# EAGLE board Power_FM (EAGLE 5.11), part 1 of 3
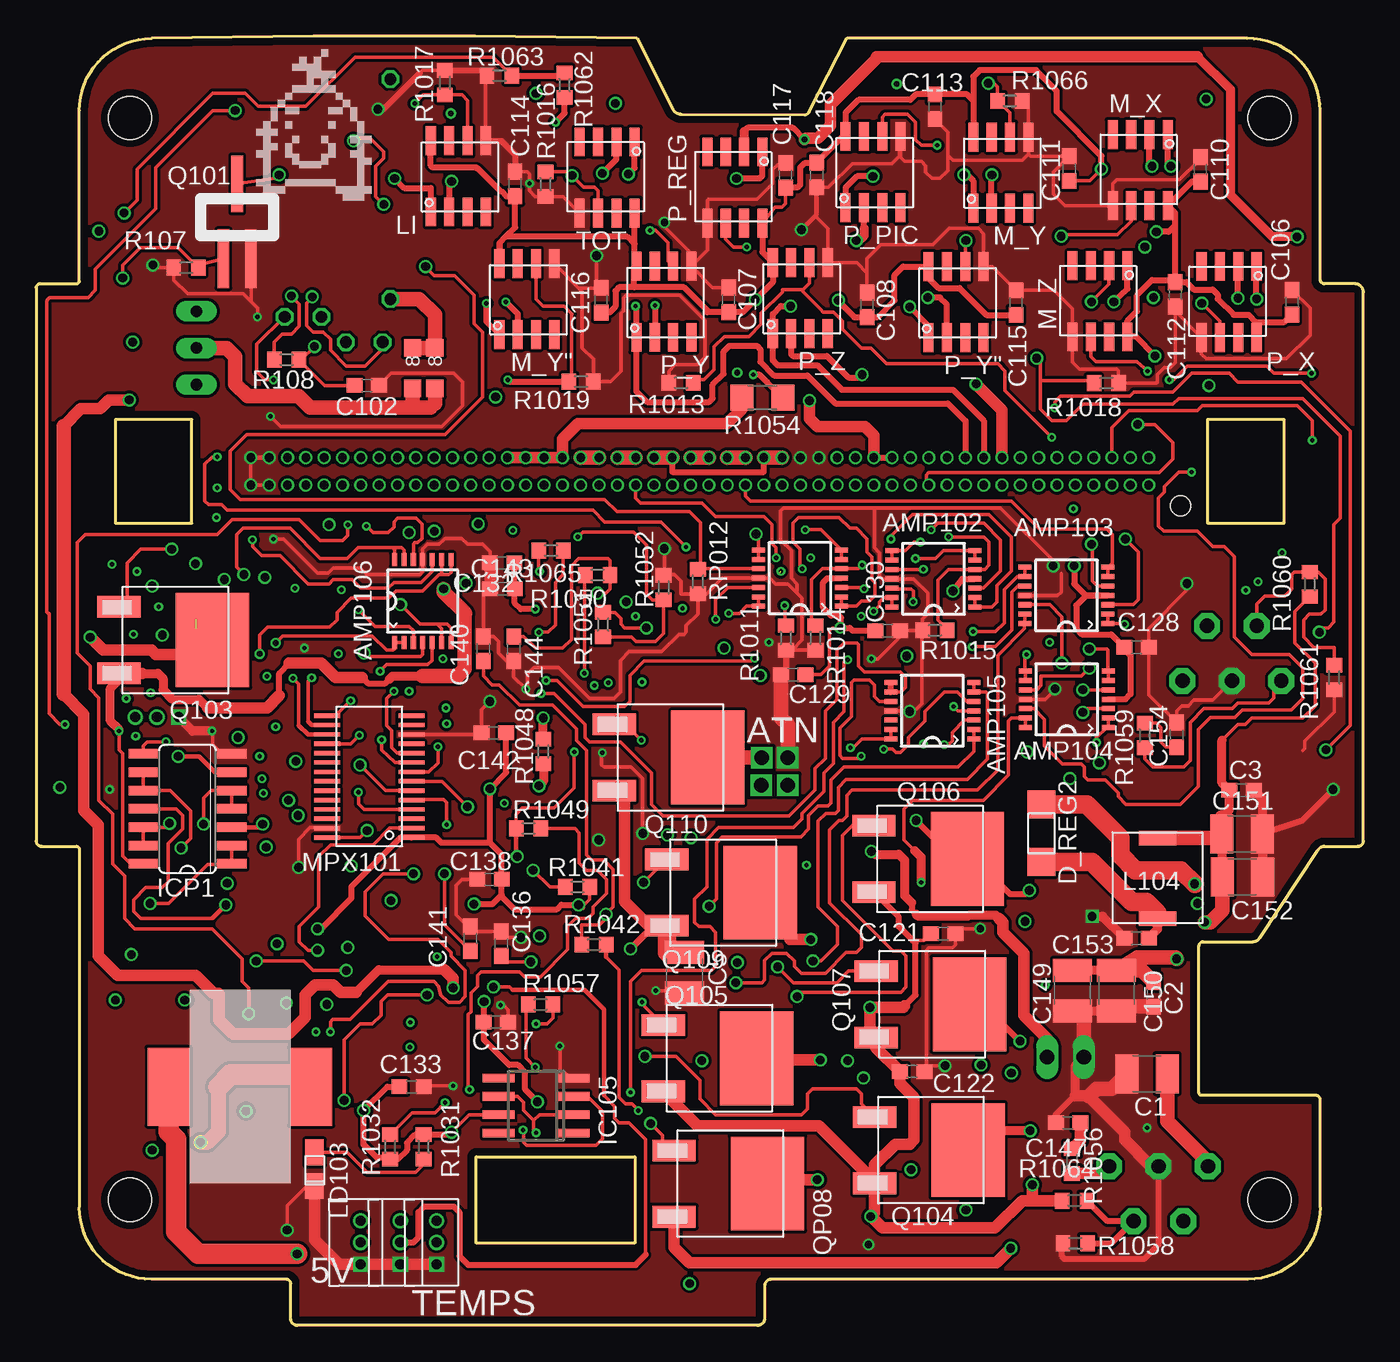
[diagram p10: board, top side]
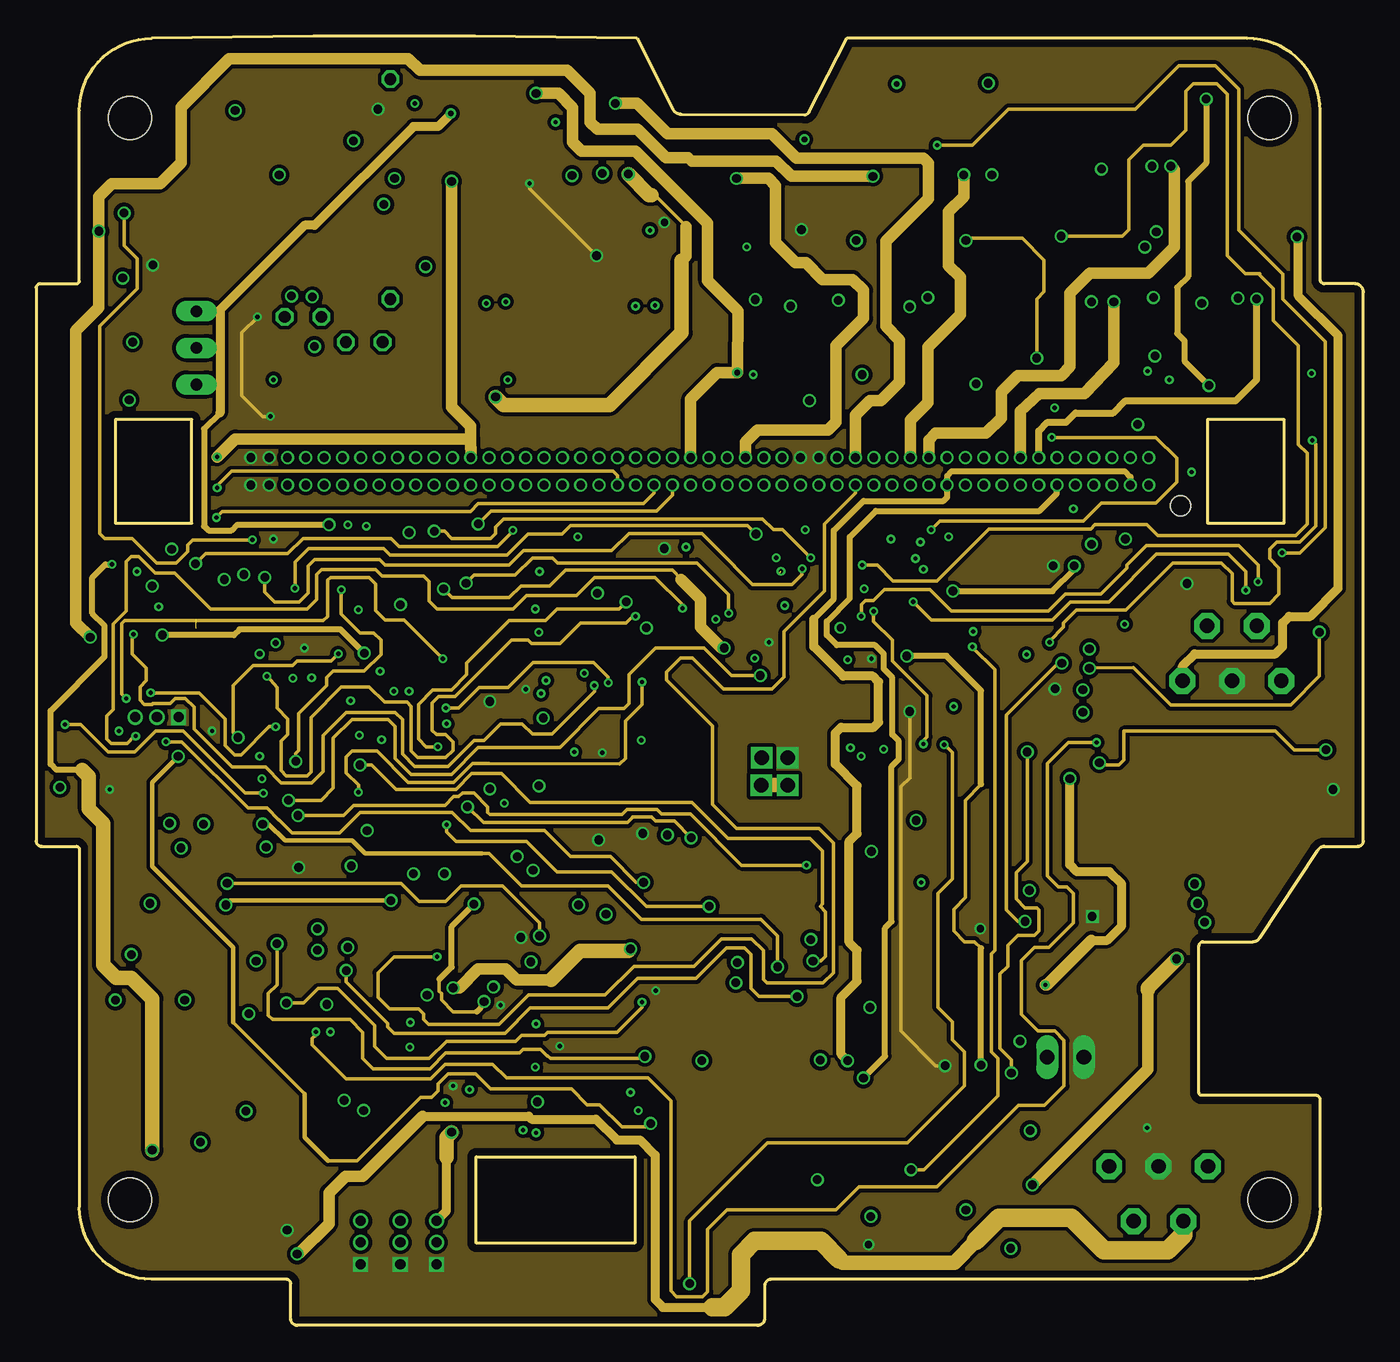
[diagram p11: board, inner layer Route2]
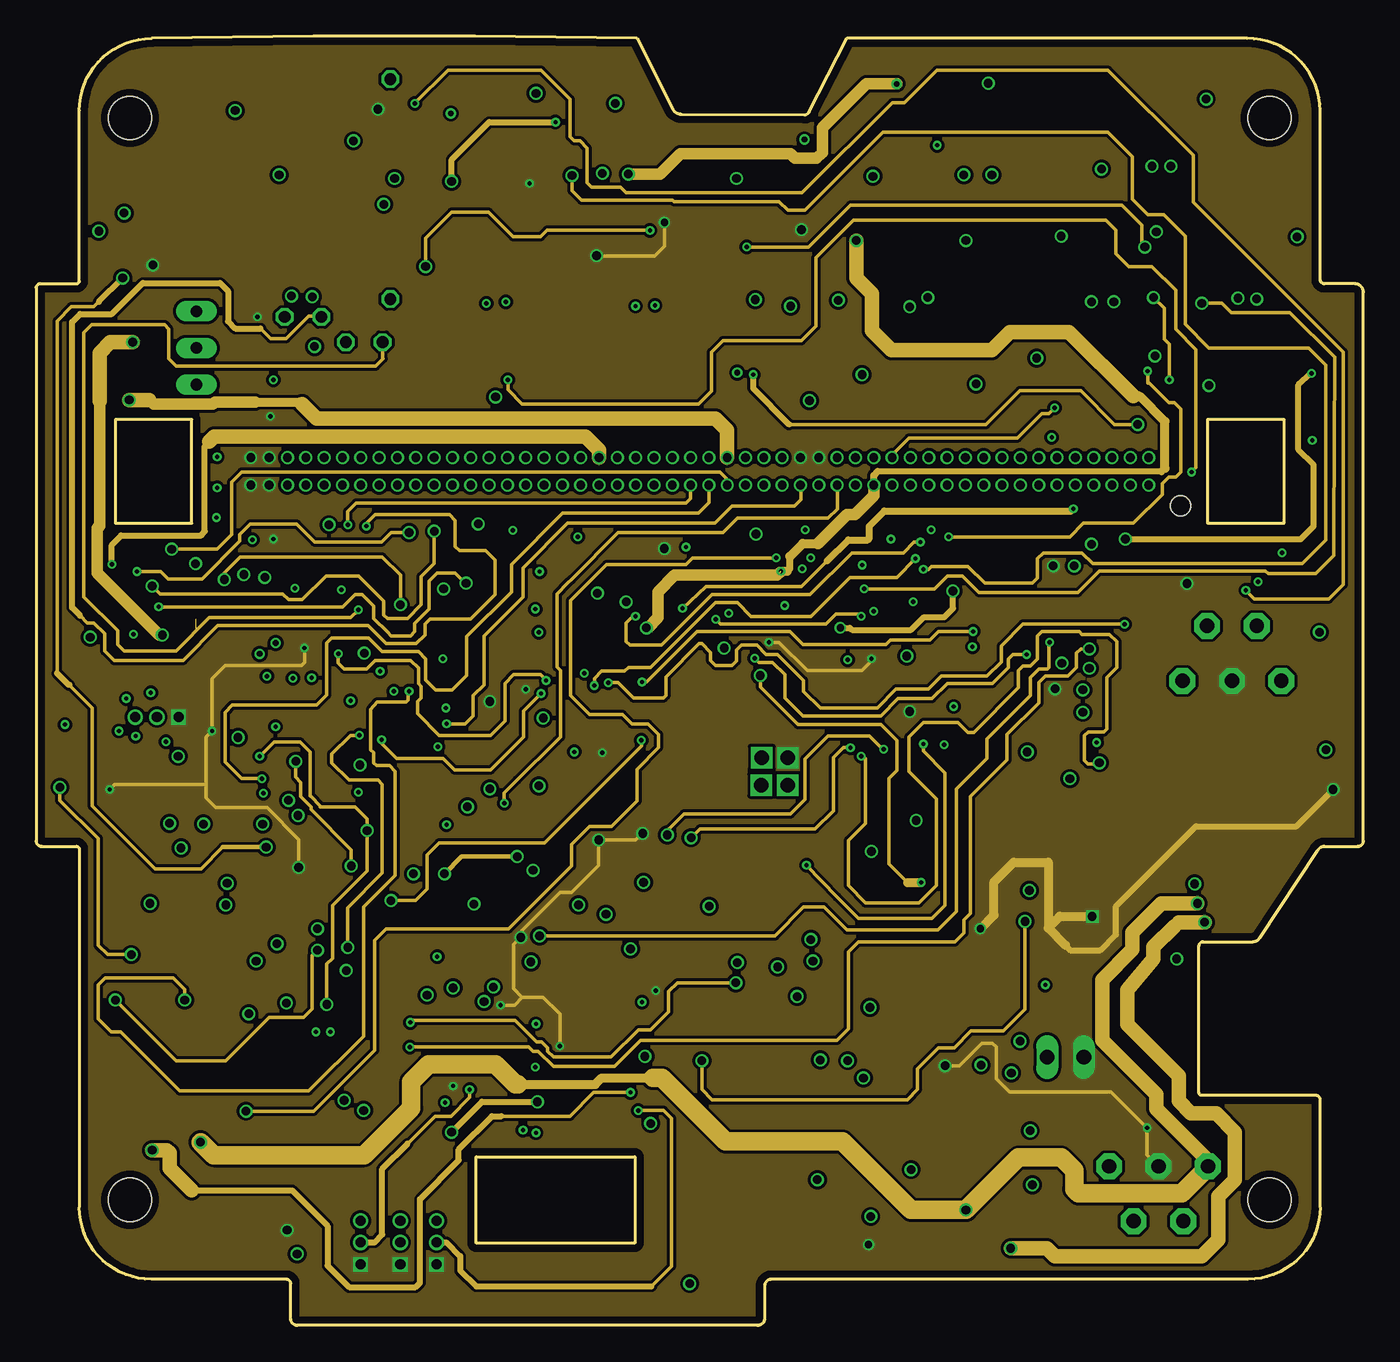
[diagram p12: board, inner layer Route15]
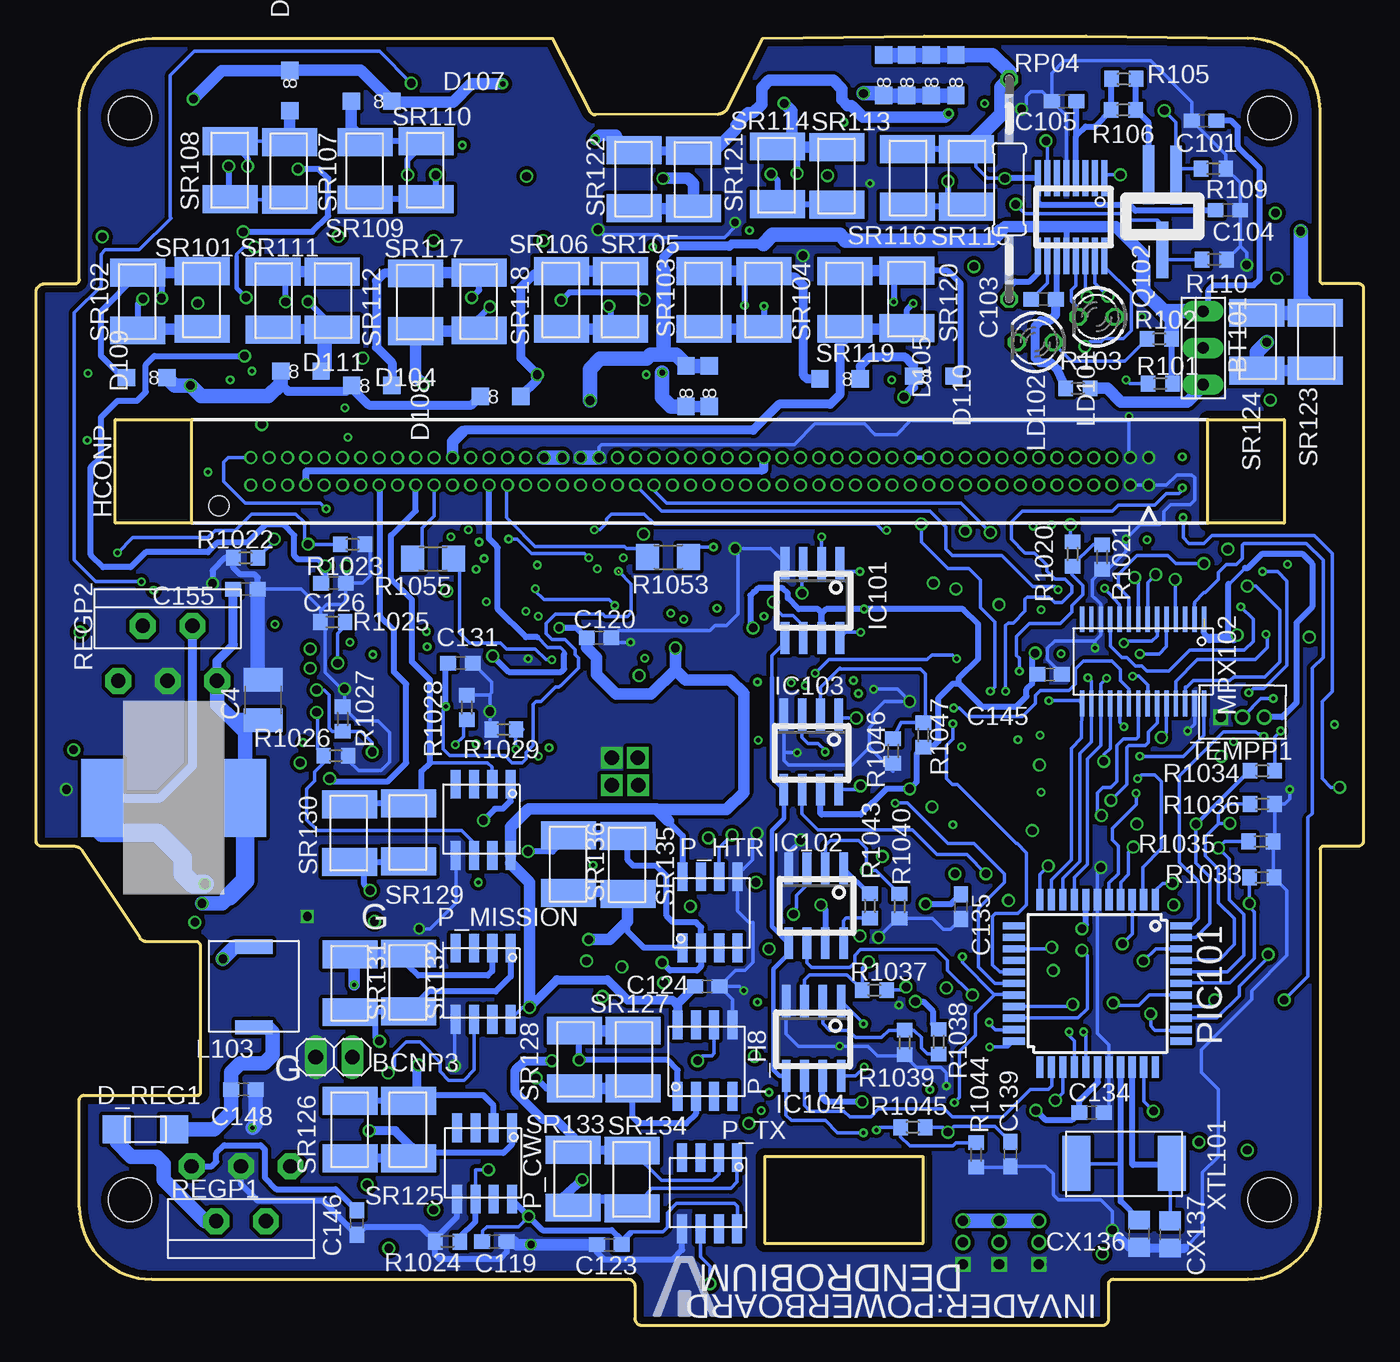
[diagram p13: board, bottom side, seen from below]

Size 92 x 89.37 mm. Coordinates in mm from the lower left corner, seen from the top.
Outline: 89,8.2 arc-90 84,3.2 50.95,3.2 arc90 50.5,2.75 50.5,0.5 arc-90 50,0 18.1,0 arc-90 17.65,0.45 17.65,2.9 arc90 17.35,3.2 8,3.2 arc-90 3,8.2 3,33 arc90 2.8,33.2 0.4,33.2 arc-90 0,33.6 0,71.9 arc-90 0.3,72.2 2.8,72.2 arc90 3,72.4 3,84.2 arc-90 8,89.2 arc-3 41.65,89.2 44.15,84.25 arc55 44.75,83.95 53.24,83.9 arc45 53.57,84.07 56.2,89.2 83.95,89.2 arc-90 89,84.2 89,72.5 arc90 89.3,72.2 91.4,72.2 arc-90 92,71.6 92,33.6 arc-90 91.6,33.2 89.3,33.2 arc62 88.8,32.9 84.8,26.85 arc-58 84.35,26.6 80.9,26.6 arc90 80.6,26.3 80.6,16.15 arc90 80.8,15.95 88.7,15.95 arc-90 89,15.65 89,8.2
Outline: 30.5,11.7 41.5,11.7 41.5,5.7 30.5,5.7 30.5,11.7
Copper layers (1+2*15+16): Top 0.018mm / dielectric 0.25mm / Route2 0.035mm / dielectric 1mm / Route15 0.035mm / dielectric 0.25mm / Bottom 0.018mm
Design rules "pban_4mil-l4": minimum track width 0.1mm, minimum drill 0.3mm, track to track 0.1mm, track to pad 0.229mm, pad to pad 0.1mm, via to via 0.1mm, smd to smd 0.1mm, copper to edge 0.5mm, drill to drill 0.5mm, minimum pad ring 0.15mm, minimum via ring 0.15mm, stop-mask expansion 4mil, vias tented up to drill 0.35mm, thermal gap 10mil
Holes 3 mm at 85.5,83.7 85.5,8.7 6.5,83.7 6.5,8.7

## Footprints (pad centres in the part's own frame; a part is rotated, then mirrored left to right if it is on the bottom)
AD8554ARUZ = smd 0.9 x 0.35: +INA -2.875,0.65; +INB -2.875,-0.65; +INC 2.875,-0.65; +IND 2.875,0.65; -INA -2.875,1.3; -INB -2.875,-1.3; -INC 2.875,-1.3; -IND 2.875,1.3; OUTA -2.875,1.95; OUTB -2.875,-1.95; OUTC 2.875,-1.95; OUTD 2.875,1.95; V+ -2.875,0; V- 2.875,0
1X02 = drill 1.016 long: 1 -1.27,0; 2 1.27,0
BAT_CON1 = drill 0.7 round: 1 -1.5,0; 2 0,0 | drill 0.7 square: 3 1.5,0
2-7D101A = drill 0.8 pad 1.422 long: P$1 -2.54,0; P$2 0,0; P$3 2.54,0
C1210 = smd 1.6 x 2.7: 1 -1.4,0; 2 1.4,0
C0603 = smd 1.1 x 1: 1 -0.85,0; 2 0.85,0
MM1639 = smd 0.406 x 2.5: P$1 -2.54,2.756; P$2 -1.88,2.756; P$3 -1.219,2.756; P$4 -0.559,2.756; P$5 0.102,2.756; P$6 0.762,2.756; P$7 1.422,2.756; P$8 2.083,2.756; P$9 2.083,-2.629; P$10 1.422,-2.629; P$11 0.762,-2.629; P$12 0.102,-2.629; P$13 -0.559,-2.629; P$14 -1.219,-2.629; P$15 -1.88,-2.629; P$16 -2.54,-2.629
C0805 = smd 1.3 x 1.5: 1 -0.95,0; 2 0.95,0
DIODE_FM = smd 1.2 x 1.2: P$1 -1.4,0; P$2 1.4,0
DIO = smd 1.93 x 1.93: P$1 3.4,0.9; P$2 -0.6,0.9
XH3B-013P-D5F = drill 0.6 pad 0.9 round: A1 -31.115,0.953; A2 -29.845,0.953; A3 -28.575,0.953; A4 -27.305,0.953; A5 -26.035,0.953; A6 -24.765,0.953; A7 -23.495,0.953; A8 -22.225,0.953; A9 -20.955,0.953; A10 -19.685,0.953; A11 -18.415,0.953; A12 -17.145,0.953; A13 -15.875,0.953; A14 -14.605,0.953; A15 -13.335,0.953; A16 -12.065,0.953; A17 -10.795,0.953; A18 -9.525,0.953; A19 -8.255,0.953; A20 -6.985,0.953; A21 -5.715,0.953; A22 -4.445,0.953; A23 -3.175,0.953; A24 -1.905,0.953; A25 -0.635,0.953; A26 0.635,0.953; A27 1.905,0.953; A28 3.175,0.953; A29 4.445,0.953; A30 5.715,0.953; A31 6.985,0.953; A32 8.255,0.953; A33 9.525,0.953; A34 10.795,0.953; A35 12.065,0.953; A36 13.335,0.953; A37 14.605,0.953; A38 15.875,0.953; A39 17.145,0.953; A40 18.415,0.953; A41 19.685,0.953; A42 20.955,0.953; A43 22.225,0.953; A44 23.495,0.953; A45 24.765,0.953; A46 26.035,0.953; A47 27.305,0.953; A48 28.575,0.953; A49 29.845,0.953; A50 31.115,0.953; B1 -31.115,-0.953; B2 -29.845,-0.953; B3 -28.575,-0.953; B4 -27.305,-0.953; B5 -26.035,-0.953; B6 -24.765,-0.953; B7 -23.495,-0.953; B8 -22.225,-0.953; B9 -20.955,-0.953; B10 -19.685,-0.953; B11 -18.415,-0.953; B12 -17.145,-0.953; B13 -15.875,-0.953; B14 -14.605,-0.953; B15 -13.335,-0.953; B16 -12.065,-0.953; B17 -10.795,-0.953; B18 -9.525,-0.953; B19 -8.255,-0.953; B20 -6.985,-0.953; B21 -5.715,-0.953; B22 -4.445,-0.953; B23 -3.175,-0.953; B24 -1.905,-0.953; B25 -0.635,-0.953; B26 0.635,-0.953; B27 1.905,-0.953; B28 3.175,-0.953; B29 4.445,-0.953; B30 5.715,-0.953; B31 6.985,-0.953; B32 8.255,-0.953; B33 9.525,-0.953; B34 10.795,-0.953; B35 12.065,-0.953; B36 13.335,-0.953; B37 14.605,-0.953; B38 15.875,-0.953; B39 17.145,-0.953; B40 18.415,-0.953; B41 19.685,-0.953; B42 20.955,-0.953; B43 22.225,-0.953; B44 23.495,-0.953; B45 24.765,-0.953; B46 26.035,-0.953; B47 27.305,-0.953; B48 28.575,-0.953; B49 29.845,-0.953; B50 31.115,-0.953 | hole 1.4: 33.315,2.4
SO8 = smd 0.6 x 2.2: 1 -1.905,-2.6; 2 -0.635,-2.6; 3 0.635,-2.6; 4 1.905,-2.6; 5 1.905,2.6; 6 0.635,2.6; 7 -0.635,2.6; 8 -1.905,2.6
SO14 = smd 0.66 x 2.032: 1 -3.81,-3.073; 2 -2.54,-3.073; 3 -1.27,-3.073; 4 0,-3.073; 5 1.27,-3.073; 6 2.54,-3.073; 7 3.81,-3.073; 8 3.81,3.073; 9 2.54,3.073; 10 1.27,3.073; 11 0,3.073; 12 -1.27,3.073; 13 -2.54,3.073; 14 -3.81,3.073
CDRH127 = smd 5.4 x 2.9: P$1 0,4.95; P$2 0,-4.95
IN = smd 1 x 2.6: P$1 6,3.1; P$2 0.4,3.1
LED3MM = drill 0.813 octagon: A -1.27,0; K 1.27,0
LED_CHIP = smd 1.778 x 1.27: P$1 -0.246,0.6; P$2 2.092,0.6
MAX4172 = smd 2 x 0.7: 1:RS+ 0,3.81; 2:RS- 0,2.54; 3:NC 0,1.27; 4:NC 0,0; 5:GND 4.93,0; 6:OUT 4.93,1.27; 7:PG 4.93,2.54; 8:V+ 4.93,3.81
ADG707 = smd 1.8 x 0.3: A0 2.925,-2.925; A1 2.925,-3.575; A2 2.925,-4.225; DA 2.925,4.225; DB -2.925,3.575; EN 2.925,-2.275; GND1 -2.925,-2.925; GND2 2.925,3.575; NC -2.925,-3.575; NC1 -2.925,2.925; NC2 -2.925,-4.225; S1A 2.925,-1.625; S1B -2.925,-2.275; S2A 2.925,-0.975; S2B -2.925,-1.625; S3A 2.925,-0.325; S3B -2.925,-0.975; S4A 2.925,0.325; S4B -2.925,-0.325; S5A 2.925,0.975; S5B -2.925,0.325; S6A 2.925,1.625; S6B -2.925,0.975; S7A 2.925,2.275; S7B -2.925,1.625; S8A 2.925,2.925; S8B -2.925,2.275; VDD -2.925,4.225
TQFP44 = smd 1.5 x 0.5: 1 -5.8,4; 2 -5.8,3.2; 3 -5.8,2.4; 4 -5.8,1.6; 5 -5.8,0.8; 6 -5.8,0; 7 -5.8,-0.8; 8 -5.8,-1.6; 9 -5.8,-2.4; 10 -5.8,-3.2; 11 -5.8,-4; 23 5.8,-4; 24 5.8,-3.2; 25 5.8,-2.4; 26 5.8,-1.6; 27 5.8,-0.8; 28 5.8,0; 29 5.8,0.8; 30 5.8,1.6; 31 5.8,2.4; 32 5.8,3.2; 33 5.8,4 | smd 0.5 x 1.5: 12 -4,-5.8; 13 -3.2,-5.8; 14 -2.4,-5.8; 15 -1.6,-5.8; 16 -0.8,-5.8; 17 0,-5.8; 18 0.8,-5.8; 19 1.6,-5.8; 20 2.4,-5.8; 21 3.2,-5.8; 22 4,-5.8; 34 4,5.8; 35 3.2,5.8; 36 2.4,5.8; 37 1.6,5.8; 38 0.8,5.8; 39 0,5.8; 40 -0.8,5.8; 41 -1.6,5.8; 42 -2.4,5.8; 43 -3.2,5.8; 44 -4,5.8
2SK1062 = smd 4.064 x 0.813: P$1 -7.95,0.95; P$2 -7.976,-0.95 | smd 3.937 x 0.813: P$3 -2.769,0
2SJ377 = smd 6.5 x 5.08: D 0,-1.27 | smd 1.5 x 3: G -2.3,-7.75; S 2.3,-7.75
R0603 = smd 1 x 1.1: 1 -0.85,0; 2 0.85,0
R1206 = smd 1.6 x 1.803: 1 -1.422,0; 2 1.422,0
LT1170 = drill 1 pad 1.778 octagon: FB:2 1.727,-3.81; GND:3 0,0; VC:1 3.429,0; VIN:5 -3.429,0; VSW:4 -1.727,-3.81
0207/15 = drill 0.813 octagon: 1 -7.62,0; 2 7.62,0
SHUNT = smd 1.93 x 3.81: P$1 0.6,1.2; P$2 4.6,1.2
LM19_XH = drill 0.7 round: 1 -1.5,0; 2 0,0 | drill 0.7 square: 3 1.5,0
SUISYOU = smd 1.93 x 3.81: P$1 0.7,2.3; P$2 7.3,2.3

## Placement (x,y rotation side)
AMP101  AD8554ARUZ  [AD8554ARUZ]  52.93,51.8 180 top
AMP102  AD8554ARUZ  [AD8554ARUZ]  62.2,51.75 180 top
AMP103  AD8554ARUZ  [AD8554ARUZ]  71.42,50.6 180 top
AMP104  AD8554ARUZ  [AD8554ARUZ]  71.44,43.4 180 top
AMP105  AD8554ARUZ  [AD8554ARUZ]  62.11,42.6 180 top
AMP106  AD8554ARUZ  [AD8554ARUZ]  26.8,50.2 90 top
BCNP3  [1X02]  71.35,18.6 180 bottom
BCNP4  BAT_CON1  [BAT_CON1]  22.5,5.75 270 top
BCNP5  BAT_CON1  [BAT_CON1]  25.25,5.75 270 top
BCNP6  BAT_CON1  [BAT_CON1]  27.75,5.75 270 top
BT101  2SA1425  [2-7D101A]  11.1,67.75 90 bottom
C1  100uF  [C1210]  77,17.45 180 top
C2  0.1uF  [C0603]  77.45,22.95 270 top
C3  0.1uF  [C0603]  83.55,37.1 0 top
C4  100uF  [C1210]  76.25,43.35 90 bottom
C5  [C1210]  44.95,24.45 270 top
C101  10u  [C0603]  11.05,83.5 180 bottom
C102  4.7n  [C0603]  22.92,65.15 180 top
C103  100p  [C0603]  22.18,71.13 0 bottom
C104  10u  [C0603]  9.4,77.3 0 bottom
C105  10u  [C0603]  20.75,84.85 180 bottom
C106  0.1u  [C0603]  87.05,70.92 90 top
C107  0.1uF  [C0603]  48,71.08 90 top
C108  0.1uF  [C0603]  57.6,70.73 90 top
C110  0.1uF  [C0603]  80.7,80.13 90 top
C111  0.1uF  [C0603]  71.6,80.18 90 top
C112  0.1uF  [C0603]  78.95,71.47 270 top
C113  0.1uF  [C0603]  62.3,84.47 270 top
C114  0.1uF  [C0603]  33.2,79.12 90 top
C115  0.1u  [C0603]  67.92,70.89 90 top
C116  0.1u  [C0603]  39.17,71.06 90 top
C117  0.1uF  [C0603]  51.95,79.72 90 top
C118  0.1uF  [C0603]  54.1,79.73 270 top
C119  0.1uF  [C0603]  60.23,5.8 0 bottom
C120  0.1uF  [C0603]  52.98,47.65 0 bottom
C121  0.1uF  [C0603]  62.87,27.15 0 top
C122  0.1uF  [C0603]  60.72,17.6 0 top
C123  0.1uF  [C0603]  52.27,5.6 180 bottom
C124  0.1uF  [C0603]  45.48,23.5 0 bottom
C126  0.1uF  [C0603]  71.38,51.45 0 bottom
C128  0.1uF  [C0603]  76.27,47 0 top
C129  0.1uF  [C0603]  52.48,45.1 180 top
C130  0.1uF  [C0603]  59.02,48.15 0 top
C131  0.1uF  [C0603]  62.58,45.9 0 bottom
C132  0.1uF  [C0603]  32.3,52.85 180 top
C133  0.1uF  [C0603]  26.03,16.55 180 top
C134  0.1uF  [C0603]  18.83,14.75 0 bottom
C135  0.1uF  [C0603]  27.9,29.03 270 bottom
C136  10u  [C0603]  32.25,26.45 90 top
C137  0.1u  [C0603]  31.87,21.03 0 top
C138  0.1u  [C0603]  31.43,30.92 180 top
C139  0.1u  [C0603]  24.47,11.88 270 bottom
C140  10u  [C0603]  31,46.9 90 top
C141  10u  [C0603]  30.1,26.8 90 top
C142  0.1u  [C0603]  31.73,41.07 180 top
C143  0.1u  [C0603]  32.33,51.07 180 top
C144  10u  [C0603]  33.1,46.9 270 top
C145  0.1u  [C0603]  21.74,45.13 180 bottom
C146  0.1u  [C0603]  69.77,7.12 270 bottom
C147  2.2uF  [C0603]  71.52,14.05 180 top
C148  0.1uF  [C0603]  77.62,16.35 0 bottom
C149  100uF  [C1210]  71.84,23.21 270 top
C150  100uF  [C1210]  74.89,23.21 270 top
C151  100u  [C1210]  83.58,34.08 0 top
C152  100u  [C1210]  83.61,31.08 0 top
C153  0.1uF  [C0603]  76.27,26.85 180 top
C154  2.2uF  [C0603]  79.05,40.93 90 top
C155  0.1uF  [C0603]  77.48,51.03 0 bottom
CHARGE_IC  MM1639  [MM1639]  20.03,76.76 0 bottom
CX136  22pF  [C0805]  15.55,6.36 270 bottom
CX137  22pF  [C0805]  13.4,6.31 270 bottom
D101  DIODE_FM  [DIODE_FM]  26.1,66.35 90 top
D102  DIODE_FM  [DIODE_FM]  27.65,66.35 90 top
D103  DIODE_FM  [DIODE_FM]  46.95,65.1 270 bottom
D104  DIODE_FM  [DIODE_FM]  68.73,65.15 180 bottom
D105  DIODE_FM  [DIODE_FM]  36.27,65.6 0 bottom
D106  DIODE_FM  [DIODE_FM]  74.4,85.59 90 bottom
D107  DIODE_FM  [DIODE_FM]  68.75,84.85 0 bottom
D108  DIODE_FM  [DIODE_FM]  59.81,64.4 180 bottom
D109  DIODE_FM  [DIODE_FM]  84.33,65.7 0 bottom
D110  DIODE_FM  [DIODE_FM]  29.78,65.8 180 bottom
D111  DIODE_FM  [DIODE_FM]  73.64,66.15 180 bottom
D112  DIODE_FM  [DIODE_FM]  45.35,65.1 270 bottom
D114  DIODE_FM  [DIODE_FM]  28.25,86.65 270 bottom
D115  DIODE_FM  [DIODE_FM]  29.95,86.65 270 bottom
D116  DIODE_FM  [DIODE_FM]  31.65,86.65 270 bottom
D117  DIODE_FM  [DIODE_FM]  33.25,86.65 270 bottom
D_REG1  DIODE_REG  [DIO]  83.02,14.48 180 bottom
D_REG2  DIODE_REG  [DIO]  70.58,32.72 90 top
HCONP  XH3B-013P-D5F_NEW  [XH3B-013P-D5F]  46,59.2 180 bottom
IC101  AD623R  [SO8]  38.19,50.24 180 bottom
IC102  AD623R  [SO8]  37.93,29.09 180 bottom
IC103  AD623R  [SO8]  38.27,39.74 180 bottom
IC104  AD623R  [SO8]  38.11,19.89 180 bottom
IC105  AD8541R  [SO8]  34.66,15.24 90 top
ICP1  7400D  [SO14]  10.5,35.8 90 top
L101  CDRH127  [CDRH127]  14.13,16.55 270 top
L102  CDRH127  [CDRH127]  82.47,36.57 270 bottom
L103  INDUCTOR  [IN]  80.01,26.66 270 bottom
L104  INDUCTOR  [IN]  74.62,34.18 270 top
LD101  [LED3MM]  18.5,69.9 180 bottom
LD102  [LED3MM]  22.75,68.15 180 bottom
LD103  SML-21X  [LED_CHIP]  18.7,11.75 270 top
LI  MAX4172  [MAX4172]  31.17,77.18 90 top
M_X  MAX4172  [MAX4172]  74.63,82.54 270 top
M_Y  MAX4172  [MAX4172]  68.77,77.44 90 top
M_Y"  MAX4172  [MAX4172]  35.92,68.67 90 top
M_Z  MAX4172  [MAX4172]  71.83,73.45 270 top
MPX101  ADG707  [ADG707]  23.09,38.04 180 top
MPX102  ADG707  [ADG707]  15.28,46.02 270 bottom
P_CW  MAX4172  [MAX4172]  62.82,13.69 270 bottom
P_H8  MAX4172  [MAX4172]  43.73,15.89 90 bottom
P_HTR  MAX4172  [MAX4172]  43.38,26.17 90 bottom
P_MISSION  MAX4172  [MAX4172]  62.92,26.15 270 bottom
P_PIC  MAX4172  [MAX4172]  59.92,77.48 90 top
P_REG  MAX4172  [MAX4172]  46.53,81.34 270 top
P_RX  MAX4172  [MAX4172]  62.92,37.51 270 bottom
P_TX  MAX4172  [MAX4172]  47.22,11.63 270 bottom
P_X  MAX4172  [MAX4172]  80.78,73.4 270 top
P_Y  MAX4172  [MAX4172]  45.42,68.48 90 top
P_Y"  MAX4172  [MAX4172]  65.67,68.46 90 top
P_Z  MAX4172  [MAX4172]  54.87,68.74 90 top
PIC101  PIC16F877PT  [TQFP44]  18.43,23.7 270 bottom
Q101  2SK1062  [2SK1062]  13.94,81.89 90 top
Q102  2SK1062  [2SK1062]  13.94,71.78 270 bottom
Q103  2SJ377  [2SJ377]  13.5,47.5 270 top
Q104  2SJ377  [2SJ377]  65.87,12.15 270 top
Q105  2SJ377  [2SJ377]  51.22,18.52 270 top
Q106  2SJ377  [2SJ377]  65.82,32.34 270 top
Q107  2SJ377  [2SJ377]  65.97,22.26 270 top
Q109  2SJ377  [2SJ377]  51.47,30 270 top
Q110  2SJ377  [2SJ377]  47.82,39.37 270 top
QP08  2SJ377  [2SJ377]  51.97,9.83 270 top
R101  1k  [R0603]  14.09,65.28 0 bottom
R102  1k  [R0603]  14.14,68.38 0 bottom
R103  150  [R0603]  19.78,64.95 0 bottom
R105  10k  [R0603]  16.6,86.4 0 bottom
R106  10k  [R0603]  16.63,84.25 0 bottom
R107  100k  [R0603]  10.39,73.32 180 top
R108  75k  [R0603]  17.36,66.93 0 top
R109  100k  [R0603]  10.39,80.18 0 bottom
R110  10k  [R0603]  10.34,73.88 0 bottom
R1011  51k  [R0603]  51.97,47.66 90 top
R1013  51k  [R0603]  44.71,65.33 0 top
R1014  51k  [R0603]  54.02,47.66 90 top
R1015  51k  [R0603]  62.29,48.18 0 top
R1016  51k  [R0603]  35.32,79.11 90 top
R1017  51k  [R0603]  28.33,86.14 270 top
R1018  51k  [R0603]  74.18,65.31 180 top
R1019  51k  [R0603]  37.78,65.41 180 top
R1020  10k  [R0603]  20.16,53.47 90 bottom
R1021  15k  [R0603]  18.11,53.27 90 bottom
R1022  51k  [R0603]  77.48,53.21 0 bottom
R1023  100k  [R0603]  70.07,54.14 180 bottom
R1024  100k  [R0603]  63.48,5.81 0 bottom
R1025  100k  [R0603]  71.43,48.76 0 bottom
R1026  100k  [R0603]  71.22,39.49 180 bottom
R1027  100k  [R0603]  70.74,42.03 270 bottom
R1028  51k  [R0603]  62.14,42.83 270 bottom
R1029  100k  [R0603]  59.58,41.31 0 bottom
R1031  1k  [R0603]  26.86,12.37 90 top
R1032  1k  [R0603]  24.54,12.37 90 top
R1033  1k  [R0603]  7.05,31.05 180 bottom
R1034  1k  [R0603]  7,38.45 180 bottom
R1035  1k  [R0603]  7.1,33.55 180 bottom
R1036  1k  [R0603]  7,36.15 180 bottom
R1037  820  [R0603]  33.88,23.24 0 bottom
R1038  2k  [R0603]  29.44,19.67 90 bottom
R1039  1k  [R0603]  31.8,19.61 270 bottom
R1040  1k  [R0603]  32.15,29.06 270 bottom
R1041  2k  [R0603]  37.52,30.39 0 top
R1042  820  [R0603]  38.67,26.39 0 top
R1043  33k  [R0603]  34.21,29.08 90 bottom
R1044  10k  [R0603]  26.84,11.82 90 bottom
R1045  10k  [R0603]  31.23,13.74 0 bottom
R1046  1k  [R0603]  32.6,39.81 270 bottom
R1047  2k  [R0603]  30.51,40.93 270 bottom
R1048  33k  [R0603]  35.16,39.77 90 top
R1049  820  [R0603]  34.13,34.44 0 top
R1050  820  [R0603]  38.93,52.01 180 top
R1051  2k  [R0603]  39.29,48.57 90 top
R1052  1k  [R0603]  43.5,51.14 90 top
R1053  100m  [R1206]  48.19,53.25 180 bottom
R1054  100m  [R1206]  50.34,64.3 0 top
R1055  100m  [R1206]  64.49,53.15 180 bottom
R1056  3k  [R0603]  71.8,11.39 270 top
R1057  33k  [R0603]  34.97,22.24 0 top
R1058  1k  [R0603]  72.02,5.7 0 top
R1059  3k  [R0603]  76.85,40.9 270 top
R1060  3k  [R0603]  88.28,51.37 270 top
R1061  1k  [R0603]  89.97,44.92 90 top
R1062  10k  [R0603]  36.63,85.96 270 top
R1063  15k  [R0603]  32.11,86.62 0 top
R1064  3k  [R0603]  71.98,8.65 180 top
R1065  33k  [R0603]  35.68,53.71 180 top
R1066  51k  [R0603]  67.49,84.87 180 top
REGP1  LT1170  [LT1170]  77.79,11.03 0 bottom
REGP2  LT1170  [LT1170]  82.88,44.67 180 bottom
RP04  0.22  [0207/15]  24.55,78.76 270 bottom
RP012  51k  [R0603]  45.87,51.56 90 top
SR101  SHUNT_10M  [SHUNT]  79.29,68.47 90 bottom
SR102  SHUNT_10M  [SHUNT]  83.74,68.37 90 bottom
SR103  SHUNT_10M  [SHUNT]  44.49,68.47 90 bottom
SR104  SHUNT_10M  [SHUNT]  40.34,68.47 90 bottom
SR105  SHUNT_10M  [SHUNT]  50.28,68.47 90 bottom
SR106  SHUNT_10M  [SHUNT]  54.38,68.47 90 bottom
SR107  SHUNT_10M  [SHUNT]  73.23,77.42 90 bottom
SR108  SHUNT_10M  [SHUNT]  77.33,77.47 90 bottom
SR109  SHUNT_10M  [SHUNT]  67.98,77.42 90 bottom
SR110  SHUNT_10M  [SHUNT]  63.78,77.47 90 bottom
SR111  SHUNT_10M  [SHUNT]  76.77,73.63 270 bottom
SR112  SHUNT_10M  [SHUNT]  72.67,73.63 270 bottom
SR113  SHUNT_10M  [SHUNT]  35.28,77.07 90 bottom
SR114  SHUNT_10M  [SHUNT]  39.43,77.12 90 bottom
SR115  SHUNT_10M  [SHUNT]  28.72,82.13 270 bottom
SR116  SHUNT_10M  [SHUNT]  32.82,82.13 270 bottom
SR117  SHUNT_10M  [SHUNT]  64.48,68.32 90 bottom
SR118  SHUNT_10M  [SHUNT]  60.08,68.37 90 bottom
SR119  SHUNT_10M  [SHUNT]  34.73,68.47 90 bottom
SR120  SHUNT_10M  [SHUNT]  30.43,68.52 90 bottom
SR121  SHUNT_10M  [SHUNT]  45.23,76.82 90 bottom
SR122  SHUNT_10M  [SHUNT]  49.35,76.85 90 bottom
SR123  SHUNT_10M  [SHUNT]  4.53,70.78 270 bottom
SR124  SHUNT_10M  [SHUNT]  8.58,70.78 270 bottom
SR125  SHUNT_10M  [SHUNT]  64.98,10.97 90 bottom
SR126  SHUNT_10M  [SHUNT]  69.03,10.97 90 bottom
SR127  SHUNT_10M  [SHUNT]  51.82,21.03 270 bottom
SR128  SHUNT_10M  [SHUNT]  55.87,21.03 270 bottom
SR129  SHUNT_10M  [SHUNT]  64.98,31.57 90 bottom
SR130  SHUNT_10M  [SHUNT]  69.08,31.52 90 bottom
SR131  SHUNT_10M  [SHUNT]  69.03,21.12 90 bottom
SR132  SHUNT_10M  [SHUNT]  64.98,21.17 90 bottom
SR133  SHUNT_10M  [SHUNT]  53.58,7.57 90 bottom
SR134  SHUNT_10M  [SHUNT]  49.48,7.52 90 bottom
SR135  SHUNT_10M  [SHUNT]  49.78,29.32 90 bottom
SR136  SHUNT_10M  [SHUNT]  53.88,29.37 90 bottom
TEMPP1  LM19_ZH  [LM19_XH]  8.38,42.16 180 bottom
TOT  MAX4172  [MAX4172]  37.68,82.03 270 top
XTL101  hassinsi  [SUISYOU]  20.59,8.94 0 bottom

## Tracks (layer width: path | path; a pad name or v marks a point on that pad's centre or on a via)
5V_OUT_CW  (via drill 0.6)
  Route2 0.254: 65.5,26.15 65.05,26.6 64.35,26.6 63.6,27.35 63.6,28.85 64.4,29.65 64.4,36.4 65.5,37.5
  Route2 0.406: v60.35,46.4 63.1,46.4 65.5,44 65.5,37.5 | v65.5,18.05 65.5,26.15
  Bottom 0.254: P_CW.2:RS- 60.28,14.43 | 65.96,15.95 SR125.P$2 | 55.4,46.55 55.4,46.75 55.65,47 56.55,47 57.25,47.7
  Bottom 0.406: HCONP.A37 60.6,54.55 60.1,54.05 60.1,54 60,53.9 60,49.65 58.05,47.7 57.25,47.7 | SR125.P$2 SR126.P$2 | 65.96,15.95 65.6,15.95 61,15.95 60.3,15.25 60.3,13.71 P_CW.2:RS- | v60.35,46.4 59.25,45.3 55.6,45.3 55.4,45.5 55.4,46.55
  Bottom 0.61: v65.5,18.05 65.6,17.95 65.6,15.95
5V_OUT_P_FMTX  (via drill 0.6)
  Route2 0.406: HCONP.A39 | HCONP.A39 63.15,57.4 62.9,57.15 57.35,57.15 55.3,55.1 55.3,50.35 53.9,48.95 | HCONP.A39 63.15,58.9 63.45,59.2 75.45,59.2 75.84,58.8 HCONP.A49
  Route2 0.61: v56.25,18.35 55.8,18.8 55.8,22.75 56.9,23.85 56.9,26 56.35,26.55 56.35,33.55 56.9,34.1 56.9,37.4 55.4,38.9 55.4,41.05 55.8,41.45 58.05,41.45 58.4,41.8 58.4,44.6 58,45 55.95,45 53.9,47.05 53.9,48.95
  Bottom 0.254: P_TX.2:RS- 44.68,10.47 45.1,10.05 48.65,10.05 50.68,12.08 SR134.P$2
  Bottom 0.61: SR134.P$2 54.73,12.12 SR133.P$2 54.78,13.08 55.95,14.25 56.85,14.25 58.8,16.2 58.8,17.7 58.15,18.35 v56.25,18.35
5V_OUT_P_MAIN  (via drill 0.6)
  Route2 0.406: HCONP.A45 70.75,58.23 70.75,57.65 69.55,56.45 58.2,56.45 56.4,54.65 56.4,50.4 54.8,48.8 54.8,47.85 55.5,47.15 58.15,47.15 58.75,46.55 58.75,45.5 59.35,44.9 59.35,40.95 59.8,40.5 59.8,39.25 59.3,38.75 59.3,28 58.85,27.55 58.85,18.65 v57.35,17.15
  Bottom 0.254: 50.65,16.4 SR127.P$2
  Bottom 0.406: P_H8.2:RS- 46.27,14.68 46.95,14 50.2,14 50.65,14.45 50.65,16.4 | SR128.P$2 56.63,16.43 v57.35,17.15
  Bottom 0.813: SR127.P$2 SR128.P$2
5V_OUT_P_MISSION  (via drill 0.3, 0.6)
  Route2 0.61: v69.95,23.6 69.9,23.6 | 73.15,26.7 74.25,26.7 75.25,27.7 75.25,30.6 74.4,31.45 72.15,31.45 71.65,31.95 v71.65,37.9
  Route2 0.813: 73.15,26.7 70.05,23.6 v69.95,23.6
  Bottom 0.254: 66.18,24.93 SR132.P$2 | SR131.P$2 70.25,25.7
  Bottom 0.406: v71.65,37.9 71.45,37.7 67.65,37.7 66.35,39 66.35,44.45 67.2,45.3 67.2,48.2 68.15,49.15 68.15,58.17 HCONP.A43 | P_MISSION.2:RS- 60.38,24.57 60.7,24.25 65.5,24.25 66.18,24.93
  Bottom 0.61: SR132.P$2 70.18,25.77
  Bottom 0.813: 70.25,25.7 69.95,25.4 v69.95,23.6
  Bottom 1.27: 70.18,25.77 SR131.P$2
5V_OUT_P_RX
  Bottom 0.254: 65.3,37.05 SR129.P$2 | 70.23,36.17 SR130.P$2 | P_RX.2:RS- 60.4,37.53 60.4,38.7 60.7,39 64.7,39
  Bottom 0.406: SR129.P$2 70.23,36.17 | 65.3,37.05 65.3,38.4 64.7,39 64.7,44.75 65.95,46 65.95,50.3 67.4,51.75 67.4,54.75 65.69,56.47 HCONP.A41
5V_OUT_PIC  (via drill 0.3, 0.6)  (2 unrouted)
  Top 0.254: R1032.1 24.56,11.5 | R1031.2 27.04,13.4 | 26,33.8 MPX101.VDD 27.04,33.81 | C137.1 31.05,21.06 | 32.28,29.85 32.28,29.72 | R1041.2 38.37,29.52 37.85,29 | C138.1 32.3,30.94 | v37.6,29.15 37.7,29.15 | IC105.7 30,14.61 v28.8,13.4 | AMP105.V+ 63.9,42.6 v63.6,42.9 | v22.75,46.6 23,46.35 26.65,46.35 26.8,46.5 AMP106.V+ | R1051.2 40.13,49.42 40.55,49 40.55,48.6 40.8,48.35 v42.3,48.35
  Top 0.406: 31.05,21.06 v31.05,22.45 | v30.35,29.2 31.63,29.2 32.28,29.85 C138.1 32.25,30.95 32.25,32.65 31.45,33.45 | v34.6,49.65 33.6,49.65 33.18,50.07 C143.1 33.18,52.82 C132.1 | 32.28,29.72 33.15,28.85 36.1,28.85 36.4,29.15 v37.6,29.15 | 37.7,29.15 37.85,29 | P_PIC.2:RS- 57.38,76.12 57.4,76.1 57.4,76.05 | C142.1 32.58,38.33 v31.45,37.2 31.45,33.45 | 31.45,33.45 28.1,33.45 27.73,33.81 MPX101.VDD 25.27,33.81 21.85,30.4 21.85,29.6 19.75,27.5 v19.5,27.5 | C137.1 31.05,21 31.05,19.8 32.8,18.05 33.4,18.05 33.9,17.55 33.9,16.35 v34.75,15.5 | v28.8,13.4 28.62,13.22 R1031.2 26.84,13.2 26.25,13.2 25.7,12.65 25.7,12.15 25.07,11.52 R1032.1 24.46,11.6 23.65,11.6 22.7,12.55 v22.7,14.9 24.35,16.55 C133.2
  Top 0.61: 57.4,76.05 57.4,75.55 57.05,75.2 v56.85,75.2
  Route2 0.254: v31.05,22.45 31.05,22.25 | 27.95,24 27.95,23.15 28.1,23 28.1,22.55 28.9,21.75 30.55,21.75
  Route2 0.406: v22.75,46.6 21.1,48.25 14.1,48.25 13.7,47.85 v8.75,47.85 | v30.35,29.2 28.8,27.65 28.8,24.85 27.95,24 | 31.05,22.25 30.55,21.75
  Route2 0.61: 28.45,11.65 28.45,7.95 BCNP6.1
  Route2 1.016: 28.45,11.65 28.45,13.05 v28.8,13.4
  Route15 0.305: 78,59.15 78.25,59.4
  Route15 0.406: v34.75,15.5 30.9,15.5 v28.8,13.4
  Route15 0.42: 58.35,59.2 77.95,59.2
  Route15 0.5: 77.95,59.2 78,59.15 | 58.35,59.2 58.06,58.92 HCONP.A35 | 52.08,52.28 52.25,52.45 52.25,53.3
  Route15 0.61: 76.05,64.4 76.5,64.4 78.25,62.65 78.25,59.4 | 54.2,54.2 53.15,54.2 52.25,53.3 | v51.62,52.28 52.08,52.28
  Route15 0.813: HCONP.A35 58.06,57.52 56.75,56.2 56.2,56.2 54.2,54.2 | 51.55,52.2 51.35,52 44.25,52 43.1,50.85 43.1,49.05 42.4,48.35 v42.3,48.35 | 4.4,64.05 4.4,55.4 4.25,55.25 4.25,52.15 8.55,47.85 v8.75,47.85
  Route15 1.016: v56.85,75.2 56.85,72.6 57.95,71.5 57.95,68.95 59.3,67.6 66.25,67.6 67.5,68.85 71.6,68.85 76.05,64.4 | v6.7,68.15 5.15,68.15 4.4,67.4 4.4,64.05
  Bottom 0.254: C134.1 19.7,15.07 | v22.7,14.9 22.55,14.75 | 29.87,40.08 R1047.2 30.95,39.64 | 22.96,44.76 C145.2 | 11.05,48.3 | 29.85,20.93 R1038.2 | C139.1 25.54,13.8 28.4,13.8 v28.8,13.4 29.14,13.74 R1045.2 | v63.6,42.9 63.8,42.7 63.8,39.95 63.35,39.5 59.5,39.5 59,39 58.3,39 58.05,39.25 58.05,39.7 57.55,40.2 57.55,43.05 57.35,43.25 57,43.25 56,44.25 55.75,44.25 55.65,44.35 55.6,44.35 54.4,45.55 54.4,46.25 54.65,46.5 54.65,46.85 55.35,47.55 56.25,47.55 56.65,47.95 56.65,48.65 56,49.3 52.7,49.3 52.55,49.15 51,49.15 50.75,49.4 50.75,51.4 v51.62,52.28 | 9.35,51.4 9.3,51.4 8.2,52.5
  Bottom 0.406: PIC101.7 19.23,27.77 v19.5,27.5 | C135.1 28.58,29.2 v30.35,29.2 | 29.85,20.93 29.85,21.8 30.5,22.45 v31.05,22.45 | v22.75,46.6 22.96,46.34 22.96,44.76 22.96,44.49 23.35,44.1 23.35,43.6 24.05,42.9 26.45,42.9 28.04,44.49 | v42.3,48.35 42.5,48.55 42.5,50.6 42.25,50.85 42.2,50.85 41.95,51.1 40.25,51.1 39.9,50.75 39.9,50.4 39.15,49.65 37.8,49.65 37.55,49.41 IC101.7 37.55,49.35 37.25,49.65 v34.6,49.65 27.75,49.65 26.7,48.6 26.7,46.2 28.04,44.86 28.04,44.49 | 29.87,40.08 29.45,40.5 29.45,43.5 28.46,44.49 28.04,44.49 | 30.95,39.64 30.95,37.7 v31.45,37.2 33.05,37.2 34.85,35.4 37.55,35.4 37.65,35.5 37.65,37.12 IC103.7 | v37.6,29.15 37.3,28.84 IC102.7 | IC104.7 37.5,17.27 37.5,15.75 37.25,15.5 v34.75,15.5 | 19.7,15.07 19.7,15.55 18.4,16.85 18.4,17.87 PIC101.28 | C134.1 20.18,14.25 22.05,14.25 v22.7,14.9 22.5,14.7 | C131.1 63.6,45.73 v63.6,42.9 | 9,47.6 9.35,47.95 9.35,51.4 | 8.2,52.5 8,52.5 7,53.5 4.25,53.5 3.55,52.8 3.55,49.8 4.65,48.7 4.65,43.15 5.64,42.16 TEMPP1.1 | 10.65,47.6 11.05,48 11.05,48.3
  Bottom 0.61: v8.75,47.85 9,47.6 10.65,47.6
  Bottom 0.813: SR124.P$2 SR123.P$2
  Bottom 1.016: BCNP4.1 BCNP5.1 BCNP6.1 | SR124.P$2 7.38,67.47 v6.7,68.15
5V_REG_A  (via drill 0.3, 0.5, 0.6)
  Top 0.254: Q103.S 5.5,44.95 5.85,44.95 5.9,44.9 | Q107.S 58.25,19.93 | C114.1 33.18,78.25 | P_Y.8:V+ 41.49,73.53 | 51.8,78.87 C117.1 51.95,77.75 51.7,77.5 51.23,77.5 P_REG.8:V+ | 78.95,76.1 78.95,76.25 | C106.1 86.88,69.9 | 75.07,47.35 C128.1 | v5.75,41.2 5.75,39.9 6,39.65 6,32.55 6.56,31.99 ICP1.14 | C121.1 61.55,26.68 60.77,26.68 | C111.1 73.03,79.33 v73.85,80.15 | C129.1 54.4,45.1 55,45.7 55,48.15 55.2,48.35 v55.75,48.35
  Top 0.406: R1064.2 71.1,8.68 | Q104.S 57.85,9.58 | P_REG.8:V+ 50.34,74.39 P_Z.8:V+ 51.06,72.31 v49.85,71.1 48.98,70.23 C107.1 46.52,70.23 46.52,70.33 44.9,71.95 41.45,71.95 | C110.1 80.11,79.28 M_X.8:V+ 78.95,77.1 78.95,76.25 78.5,75.8 v77.65,75.8 | C112.1 78.95,76.1 | v77.55,67.2 76.23,68.52 M_Z.8:V+ 75.64,69.64 76.3,70.3 76.3,71.4 77.35,72.45 78.82,72.45 C112.1 | AMP102.V+ 64.2,51.75 v63.55,50.9 | AMP101.V+ 54.85,51.8 54.55,51.5 54.55,49.75 55.1,49.2 55.65,49.2 55.8,49.05 55.8,48.4 v55.75,48.35 56.4,48.35 56.6,48.15 C130.1 | C122.1 60.05,17.6 | 60.2,22.15 60.95,22.9 60.95,26.5 60.77,26.68 59.8,27.65 59.8,28.31 Q106.S | v71.95,52.65 71.95,51.4 72.75,50.6 AMP103.V+ 72.8,50.6 72.1,49.9 72.1,48.3 72.5,47.9 74.52,47.9 75.07,47.35 | C128.1 75.42,46.88 75.85,46.45 75.85,43.75 75.5,43.4 AMP104.V+ | C112.1 79.73,72.32 80.25,71.8 81.55,71.8 81.9,71.45 81.9,71.15 83,70.05 84.05,70.05 84.55,69.55 | 84.55,69.55 84.55,68.51 P_X.8:V+ | 84.55,69.55 86.53,69.55 C106.1 | v73.85,80.15 73.85,81.05 70.75,84.15 70.75,85.55 69.3,87 65.4,87 64.95,86.55 64.95,84.9 | 64.95,84.9 M_Y.8:V+ | 64.95,84.9 64.53,85.32 C113.1 60.97,85.32 60.6,84.95 57,84.95 56.11,84.06 P_PIC.8:V+ 55.93,82.41 C118.1 54.07,80.55 53.25,80.55 52.95,80.25 52.95,79.05 52.77,78.87 C117.1 | C116.1 39.76,70.21 40.15,70.6 40.15,71.7 40.4,71.95 41.45,71.95 | 41.49,73.53 41.49,74.95 | 41.49,74.95 TOT.8:V+ | C114.1 33.2,76.1 32.55,75.45 | 32.11,75.01 32.1,75 M_Y".8:V+ 32.11,75.01 | 32.55,75.45 32.11,75.01 | 32.55,75.45 40.99,75.45 41.49,74.95 | 33.18,78.25 32.6,78.25 32.25,78.6 32.2,78.6 30.6,80.2 30.55,80.2 30.5,80.25 27.5,80.25 27.35,80.4 LI.8:V+
  Top 0.406: v55.6,71.05 55.6,71 56.72,69.88 C108.1 57.62,69.9 58.35,69.9 59.5,71.05 59.5,72.8 60.09,73.39 P_Y".8:V+ 61.9,73.35 61.9,72.55 62.55,71.9 64,71.9 65.86,70.04 C115.1 | P_Y.8:V+ 41.45,73.25 41.45,71.95 | 16.85,43.65 16.85,45.2 17.55,45.9 | 24.5,44.8 24.2,44.5 23,44.5 22.6,44.9
  Top 0.61: C150.1 C149.1 | 24.5,44.8 24.7,45 26.8,45 | 11.9,42.8 11.3,43.4 9.45,43.4 8.8,44.05 8.8,44.85 8.45,45.2 7.35,45.2 | 5.9,44.9 5.15,44.15 5.15,41.9 5.75,41.3 v5.75,41.2
  Top 0.813: 68.9,8.65 68.35,8.65 66.45,6.75 58.65,6.75 v57.85,7.55 58.12,7.82 Q104.S | 68.9,8.65 R1064.2 | v69.05,9.75 69.05,8.8 68.9,8.65 | Q105.S 45.84,13.85 54.25,13.85 58.12,9.98 Q104.S | Q104.S 58.12,11.12 59.55,12.55 60.55,12.55 60.85,12.85 60.85,15.8 59.87,16.78 C122.1 58.22,19.25 Q107.S 57.8,20.38 v57.8,22.05 60.1,22.05 60.2,22.15 | 22.6,44.9 20.75,44.9 19.75,45.9 17.55,45.9 | 16.85,43.65 16,42.8 11.9,42.8 | Q103.S 7.35,45.2
  Top 1.016: v79.05,25.4 arc90 78.95,25.5 76.33,25.5 C150.1 76.64,24.61 C2.1 | 29.7,49.4 28.25,50.85 v28.25,51.05 | 29.7,49.4 29.75,49.35 | 26.8,45 29.2,45 29.7,45.5 29.7,49.4
  Route2 0.254: v28.25,51.05 28.85,50.45 32.8,50.45 33.6,51.25 35.6,51.25 36.7,52.35 44.1,52.35 44.7,51.75 44.7,51.7 | 71.95,52.4 v71.95,52.65 | 47.5,46.95 v47.69,46.95
  Route2 0.406: 71.95,52.4 70.45,50.9 v63.55,50.9
  Route2 0.813: v69.05,9.75 77.05,17.75 77.05,23.25 | 47.5,46.95 46.05,48.4 46.05,50.35 44.7,51.7
  Route2 1.016: 77.05,23.25 77.05,23.4 v79.05,25.4
  Route15 0.406: v63.55,50.9 63.55,49.7 62.95,49.1 61.55,49.1 60.65,48.2 56.55,48.2 56.4,48.35 v55.75,48.35
  Bottom 0.254: v57.85,7.55 58.55,6.85 60.75,6.85 61.05,6.55 61.05,5.83 C119.1 | P_MISSION.8:V+ 58.28,22.05 v57.8,22.05 | 48.15,34.95 48.15,34.9 | 47.19,32.7 47.14,32.65 | R1034.1 6.15,40.8 v5.75,41.2 | 43.4,7.25 43.4,8.25 43.6,8.45 47.6,8.45 48.25,7.8 48.25,6.8 48.55,6.5 50.72,6.5 50.82,6.4
  Bottom 0.406: 72.2,51.48 C126.1 71.95,51.45 v71.95,52.65 72.4,53.1 73.85,53.1 74.1,53.35 74.1,54.75 74.85,55.5 76.1,55.5 77.35,54.25 79.45,54.25 80.1,53.6 84.4,53.6 85.45,52.55 87.35,52.55 88.2,53.4 88.2,59.5 87.5,60.2 87.5,62.95 86.35,64.1 85,64.1 84.4,64.7 84.4,66.6 83.8,67.2 v77.55,67.2 | 43.4,7.25 43.4,6.21 P_TX.8:V+ | P_HTR.8:V+ 47.19,32.7 47.19,33.94 48.15,34.9 | P_RX.8:V+ 59.11,32.01 | v77.65,75.8 72.85,75.8 71.75,76.9 71.75,79.5 72.4,80.15 v73.85,80.15 | v55.6,71.05 55.05,71.6 50.35,71.6 v49.85,71.1 | P_CW.8:V+ 59.01,8.71 v57.85,7.55 56.9,6.6 52.1,6.6 51.42,5.92 C123.1 51.42,5.8 50.82,6.4 | v63.55,50.9 63.43,50.78 | C120.1 54.53,48.35 v55.75,48.35
  Bottom 0.61: v57.8,22.05 55.9,23.95 52.4,23.95 51,22.55 47.9,22.55 47.54,22.19 | 47.54,22.19 P_H8.8:V+ | C124.1 47.54,22.29 47.54,22.19
  Bottom 0.813: 59.11,32.01 57.8,30.7 v57.8,22.05 | 48.95,35.75 49,35.8 57.85,35.8 59.11,34.54 P_RX.8:V+ | 48.95,35.75 48.15,34.95 | 48.95,35.75 44.15,35.75 42.95,36.95 42.95,43.8 43.9,44.75 47,44.75 47.69,45.44 | v47.69,46.95 47.69,45.44 | 47.69,45.44 49.38,43.75 51.8,43.75 53.15,45.1 53.15,46.3 53.83,46.98 C120.1
  Bottom 1.016: L103.P$2 78.19,26.26 v79.05,25.4
5V_REG_B  (via drill 0.6)
  Top 0.254: R1060.2 87.25,49.49 87.25,47.3 88.65,45.9 88.65,42.95 87.8,42.1 84.25,42.1 83.8,41.65 83.3,41.65 82.2,40.55
  Top 0.61: C152.1 82.21,31.49 82.21,33.55 82.21,34.71 C151.1 82.45,34.95 | 82.2,40.55 82.2,37.6 C3.1 82.7,35.7 82.2,35.2
  Top 0.813: v67.55,5.35 66.55,4.35 45.3,4.35 44.22,5.43 QP08.S
  Top 1.016: 82.45,34.95 82.2,35.2 | L104.P$2 82.21,33.78 82.21,33.55 | 82.21,31.49 82.21,28.76 81.4,27.95 v81,27.95
  Route15 1.016: v67.55,5.35 70.05,5.35 70.6,4.8 80.8,4.8 81.95,5.95 81.95,8.95 83.1,10.1 83.1,13.4 81.8,14.7 80.05,14.7 79.2,15.55 79.2,17.3 75.65,20.85 75.65,23.25 77.45,25.4 77.45,26.25 78.9,27.65 79.2,27.95 v81,27.95
@P_CUR_ATN  (via drill 0.3, 0.6)
  Top 0.254: AMP105.-IND AMP105.OUTD 57.25,40.65 56.65,40.05 v56.45,40.05 | MPX101.S5B 28.14,37.72 v29.9,35.95
  Route2 0.254: v29.9,35.95 31,34.85 41,34.85 41.35,35.2 41.35,35.25 42.65,35.25 42.95,34.95 44.25,34.95 v45.4,33.8
  Route15 0.254: v45.4,33.8 46,34.4 54,34.4 55.25,35.65 55.25,39.35 55.95,40.05 v56.45,40.05
@P_CUR_BUS  (via drill 0.3)
  Top 0.254: AMP103.-INA AMP103.OUTA 75.4,48.65 v75.45,48.6
  Route2 0.254: v39.65,44.55 39.65,44.95 38.65,45.95 34.45,45.95 32.7,44.2 30.7,44.2 29.3,42.8 v28.4,42.8
  Route15 0.254: v39.65,44.55 40.35,44.55 41.4,43.5 43.5,43.5 43.65,43.65 43.65,44.95 45.95,47.25 46.15,47.25 46.75,46.65 46.75,46.1 47.1,45.75 48.25,45.75 48.55,46.05 48.55,46.8 48.9,47.15 49.95,47.15 50.6,46.5 51.4,46.5 53.2,44.7 53.2,43.95 54.35,42.8 58.3,42.8 59.6,44.1 61.85,44.1 62.75,45 65.9,45 66.9,46 66.9,47.1 68.4,48.6 v75.45,48.6
  Bottom 0.254: MPX102.S2A 16.25,44.1 16.85,44.7 16.85,45.45 17.45,46.05 19.4,46.05 19.95,45.5 19.95,44.45 20.4,44 22.4,44 22.75,43.65 22.75,43.1 23.65,42.2 27.4,42.2 28,42.8 v28.4,42.8
@P_CUR_CW  (via drill 0.3)
  Top 0.254: AMP103.OUTC AMP103.-INC 68,51.9 67.1,51 67.1,48.7 66.5,48.1 v64.95,48.1 | MPX101.S8B 22.73,35.77 22.35,36.15 v22.35,36.95
  Route2 0.254: v22.35,36.95 22.35,37.45 21.5,38.3 21.5,39.4 21.9,39.8 23.65,39.8 25.8,37.65 28.95,37.65 30.25,38.95 31.4,38.95 40.45,38.9 40.85,39.3 40.85,41.9 42,43.05 v42,44.6
  Route15 0.254: v64.95,48.1 62.55,48.1 61.95,47.5 59.2,47.5 58.9,47.2 53.15,47.2 52.25,48.1 45.8,48.1 42.3,44.6 v42,44.6
@P_CUR_HTR  (via drill 0.6)
  Top 0.254: AMP105.OUTB AMP105.-INB 65.85,43.9 65.95,43.8 65.95,39.25 64.55,37.85 56.15,37.85 55.6,37.3 55.6,35.7 55.4,35.5 54.75,35.5 54.2,34.95 54.2,29 55.55,27.65 55.55,26.4 54.4,25.25 v53.85,25.25 | MPX101.S6B 24.23,37.06 v22.45,38.85
  Route2 0.254: v22.45,38.85 23.25,38.85 24.95,37.15 29.1,37.15 30.2,38.25 32.25,38.25 34.25,36.25 45.45,36.25 47.95,33.75 53.65,33.75 54.5,32.9 54.5,29.2 54.35,29.05 54.73,28.68 54.73,25.57 54.4,25.25 v53.85,25.25
@P_CUR_LI  (via drill 0.3, 0.6)
  Top 0.254: AMP102.OUTD AMP102.-IND 58.75,50.45 58.45,50.15 58.45,49.9 v58.05,49.5
  Route2 0.254: v18.15,35.35 21.3,35.35 22,36.05 28.35,36.05 28.95,36.65 29.3,36.65 29.55,36.9 30.35,36.9 31.3,35.95 31.3,35.55 31.45,35.4 40.6,35.4 40.95,35.75 43.05,35.75 43.35,35.45 45.35,35.45 48.9,31.9 v53.4,31.9 | v58.05,49.5 58.05,48.8 59.35,47.5 59.35,46.05 61.75,43.65 61.75,40.8 61.5,40.55 v61.5,40.3
  Route15 0.254: v53.4,31.9 55.5,29.7 57,28.2 62.1,28.2 63,29.1 63,38.3 61.5,39.8 v61.5,40.3
  Bottom 0.254: MPX102.S3A 15.61,40.8 15.75,40.65 16.65,40.65 17.1,40.2 17.1,37.7 17.5,37.3 18.05,37.3 18.45,36.9 18.45,35.65 v18.15,35.35
@P_CUR_M_X  (via drill 0.3, 0.6)
  Top 0.254: AMP101.-INB AMP101.OUTB 54.41,55.15 v53.3,55.15
  Route2 0.254: v11.05,52.8 11.75,53.5 17.45,53.5 18.5,54.55 24.6,54.55 25.15,54 32,54 33.05,55.05 v33.05,55.1
  Bottom 0.254: v11.05,52.8 13,52.8 13.55,53.35 15.7,53.35 17,52.05 17,51.2 16.25,50.45 MPX102.S3B | v33.05,55.1 33.3,55.1 33.75,55.55 49.15,55.55 49.85,56.25 52.1,56.25 52.45,55.9 52.45,55.6 52.9,55.15 v53.3,55.15
@P_CUR_M_Y  (via drill 0.3, 0.6)
  Top 0.254: AMP101.-IND AMP101.OUTD 49.3,49.85 49.25,49.85 48.75,49.35 v48,49.35
  Route2 0.254: v48,49.35 48,50.65 45.8,52.85 37.55,52.85 36.15,52.85 35.8,53.2 34.4,53.2 33.2,52 30.35,52 v29.8,51.45
  Route15 0.254: v8.5,49.8 12.9,49.8 19.65,49.8 | 19.65,49.8 20.15,49.8 | 19.65,49.8 21.25,49.8 22.1,50.65 22.6,50.65 23.4,49.85 23.4,49.25 23.4,49 24.35,48.05 24.6,47.8 25.95,47.8 26.25,48.1 26.25,48.65 27.25,49.65 27.25,50.7 27.25,50.8 27.25,51.6 27.55,51.9 27.8,52.15 29.05,52.15 29.75,51.45 v29.8,51.45
  Bottom 0.254: v8.5,49.8 7.65,48.95 7.65,47.4 8.25,46.8 8.85,46.8 12.05,46.8 13.5,45.35 15,45.35 15.25,45.6 15.3,45.65 15.35,45.7 15.8,45.7 16.4,46.3 16.75,46.3 16.9,46.45 17.55,47.1 MPX102.S1B
@P_CUR_M_Y2  (via drill 0.3, 0.6)
  Top 0.254: AMP104.OUTD AMP104.-IND 67.6,42.1 67.4,41.9 67.4,38.15 65.65,36.4 60.75,36.4 60.15,35.8 60.15,33.65 60.9,32.9
  Top 0.61: 60.9,32.9 61.35,32.45 v61.35,30.7
  Route2 0.254: v17.5,36.4 19.75,36.4 20.6,37.25 20.6,40.7 21.9,42 24.4,42 24.9,41.5 24.9,39.3 26,38.2 28.8,38.2 30.65,40.05 36.3,40.05 39,42.75 40.75,42.75 41.1,43.1 41.1,45.1 42.95,46.95 46.3,46.95 48.2,45.05 v50.2,45.05
  Route15 0.254: 60.4,30.7 59.1,32 59.1,37.9 59.65,38.45 59.65,40.55 58.55,41.65 52.8,41.65 50.2,44.25 v50.2,45.05
  Route15 0.61: 60.4,30.7 v61.35,30.7
  Bottom 0.254: MPX102.S5A 14.3,41.75 14.9,41.15 14.9,40.4 15.1,40.2 16.25,40.2 16.4,40.05 16.4,37.5 v17.5,36.4
@P_CUR_M_Z  (via drill 0.3)
  Top 0.254: AMP102.-INB AMP102.OUTB 62.9,53.7 62.35,53.15 v60.95,53.15
  Route2 0.254: v38.7,44.35 38.7,43.95 35.75,41 34.4,41 33.7,41.7 32.2,41.7 31.05,40.55 30.35,40.55 28.55,38.75 26.25,38.75 25.4,39.6 25.4,42 24.9,42.5 21.5,42.5 19.9,40.9 19.9,38.4 19.1,37.6 17,37.6 15.9,38.7 13.6,38.7 10.95,41.35 10.95,42.85 10.35,43.45 9.65,43.45 9.3,43.1 8.1,43.1 8.05,43.05 7.5,43.05 7.2,43.35 7.2,44.25 7.65,44.7 7.65,45.55 6.65,46.55 6.65,47.8 v6.75,47.9
  Route15 0.254: v38.7,44.35 38.7,44.85 39.2,45.35 40.8,45.35 41.05,45.6 42.6,45.6 47.1,50.1 48.6,50.1 49.55,49.15 53.7,49.15 56.4,51.85 59.65,51.85 v60.95,53.15
  Bottom 0.254: MPX102.S7A 13,44.64 11.5,46.15 7.5,46.15 6.65,47 6.65,47.8 v6.75,47.9
@P_CUR_P_X  (via drill 0.3, 0.6)
  Top 0.254: AMP101.-INA AMP101.OUTA 56.85,49.85 57.2,50.2 57.75,50.2 58.15,50.6 58.15,51.5 57.95,51.7 57.95,53.25 57.6,53.6 57.6,54.5 56.85,55.25 56.4,55.25 55.65,56 52.85,56 52.45,55.6 52.45,54.3 52.95,53.8 52.95,52.6 v53.1,52.45
  Route2 0.254: v15.85,51.85 15.85,50.85 16.55,50.15 18.25,50.15 18.85,50.75 18.85,52.65 19.3,53.1 23.8,53.1 24.2,52.7 32.8,52.7 33.8,53.7 39.9,53.7 41.1,54.9 46.15,54.9 48.4,52.65 48.4,52.6 49.65,51.35 52.4,51.35 53.1,52.05 v53.1,52.45
  Bottom 0.254: MPX102.S4B 15.6,51.6 v15.85,51.85
@P_CUR_P_Y  (via drill 0.3, 0.6)
  Top 0.254: AMP101.-INC AMP101.OUTC 50.05,54.69 v49.9,54.85
  Route2 0.254: v17.95,51.1 17.95,52.9 18.9,53.85 24.1,53.85 24.55,53.4 32.65,53.4 34.1,54.85 36.45,54.85 37.05,55.45 49.3,55.45 v49.9,54.85
  Bottom 0.254: MPX102.S2B 16.91,49.95 v17.95,51.1
@P_CUR_P_Y2  (via drill 0.3, 0.6)
  Top 0.254: AMP104.-INC AMP104.OUTC 68.55,45.36 68.55,46.4 v68.65,46.5 | v35.35,44.7 36.1,44.7 37.9,42.9 40.8,42.9 41.15,43.25 41.15,45.05 42.15,46.05 49.6,46.05 v49.8,46.25
  Route2 0.254: v14,40.75 13.66,41.09 MPX102.S6A 13.66,44.36 15.05,45.75 17.8,45.75 18.1,46.05 20.45,46.05 v20.95,46.55
  Route15 0.254: v20.95,46.55 20.95,45.9 21.35,45.5 22.9,45.5 23.5,46.1 25.95,46.1 26.5,45.55 26.5,44.5 26.7,44.3 26.7,43.5 26.45,43.25 26.45,42.4 27.95,40.9 31.5,40.9 32.5,41.9 32.5,44.5 33.1,45.1 34.95,45.1 v35.35,44.7 | v68.65,46.5 67.7,46.5 67.4,46.2 67.4,45.6 66.3,44.5 63.15,44.5 62.1,43.45 59.75,43.45 58.55,42.25 53.15,42.25 51.9,43.5 51.9,45.1 51.05,45.95 50.1,45.95 v49.8,46.25
  Bottom 0.254: 13.66,43.8 MPX102.S6A 13.66,41.09 v14,40.75
@P_CUR_P_Z  (via drill 0.3, 0.6)
  Top 0.254: AMP102.-INA AMP102.OUTA 66.25,49.8 66.6,50.15 66.6,51.3 67.6,52.3 67.6,54.65 66.05,56.2 60.75,56.2 59.25,54.7 v59.25,54.5
  Route2 0.254: v27.6,55.05 28.3,55.05 28.8,54.55 31.5,54.55 31.85,54.9 31.85,55.35 32.4,55.9 50.35,55.9 51.1,55.15 51.75,55.15 v53.7,53.2
  Route15 0.254: v8.05,51.25 8.6,50.7 17.1,50.7 17.5,50.3 18.45,50.3 20.1,51.95 22.35,51.95 24.1,50.2 24.1,49.25 24.35,49 25.75,49 26.7,49.95 26.7,51.9 27.6,52.8 v27.6,55.05
  Bottom 0.254: MPX102.S8A 12.35,44.25 12.25,44.25 11.8,44.7 9.25,44.7 9,44.95 6.85,44.95 5.8,46 5.8,49.6 7.45,51.25 v8.05,51.25 | v53.7,53.2 54,53.5 57.65,53.5 58.65,54.5 v59.25,54.5
@P_CUR_PIC  (via drill 0.3, 0.6)
  Top 0.254: AMP103.-INB AMP103.OUTB 74.6,52.86 74.6,54.8 74.2,55.2 69.55,55.2 67.6,57.15 49.5,57.15 49.17,57.47 HCONP.A28
  Route2 0.254: v16.6,41.5 16.15,41.5 14.2,39.55 13.75,39.55 13.1,40.2 13.1,42.05 11.3,43.85 v7.95,43.85
  Route15 0.254: v25.85,54.95 24.6,54.95 23.95,54.3 19.3,54.3 18.05,55.55 14.85,55.55 14.1,54.8 14.1,54.35 11.5,51.75 9.15,51.75 8.65,52.25 v7,52.25
  Bottom 0.254: MPX102.S1A 16.9,41.8 v16.6,41.5 | v25.85,54.95 27.9,57 48.3,57 49.2,57.9 49.2,58.25 HCONP.A28 | v7,52.25 5.95,52.25 5.3,51.6 5.3,45.75 6.9,44.15 7.65,44.15 v7.95,43.85
@P_CUR_RX  (via drill 0.3)
  Top 0.254: AMP104.-INA AMP104.OUTA 74.2,41.45 73.5,40.75 v73.5,40.4
  Route2 0.254: v73.5,40.4 71.55,40.4 70.1,38.95 70.1,31.15 70.85,30.4 71.45,30.4 71.9,29.95 71.9,27.9 70.2,26.2 69.2,26.2 68.3,25.3 68.3,21.55 69.45,20.4 70.6,20.4 71.25,19.75 71.25,16.6 69.9,15.25 68.1,15.25 62.45,9.6 57.05,9.6 55.45,8 47.9,8 46.55,6.65 46.55,2.35 46.2,2 44.4,2 44,2.4 44,15.55 42.4,17.15 32.6,17.15 31.65,18.1 28.35,18.1 27.35,17.1 21.5,17.1 19.15,19.45 19.15,19.9 19.4,20.15 v19.4,20.35
  Bottom 0.254: v19.4,20.35 19.23,20.18 PIC101.27
@P_CUR_S_TOT  (via drill 0.3)
  Top 0.254: AMP102.-INC AMP102.OUTC 60.25,53.7 60.85,54.3 v61.3,54.3
  Route2 0.254: 41.4,49.15 v41.55,49.15 41.35,49.15 40.9,48.7 37.75,48.7 36.3,47.25 34.35,47.25 34.1,47.5 32.95,47.5 29.05,43.6 27.9,43.6 27.45,43.15 27.45,41.25 27.75,40.95 28.4,40.95 28.9,40.45 28.9,39.85 28.4,39.35 26.45,39.35 26,39.8 26,42.9 25.7,43.2 24.15,43.2 23.1,44.25 21.15,44.25 19.05,42.15 19.05,38.35 18.8,38.1 17.35,38.1 17,38.45 17,40.5 17.45,40.95 17.45,42.05 16.7,42.8 16.7,44.2 v16,45
  Route15 0.254: v61.3,54.3 60.85,54.3 60.1,53.55 56.55,53.55 53.65,50.65 46.85,50.65 43.35,47.15 41.15,47.15 40.9,47.4 40.9,48.7 41.35,49.15 v41.55,49.15
  Bottom 0.254: MPX102.S4A 14.96,43.75 14.95,43.76 14.95,44.4 15.55,45 v16,45
@P_CUR_TX  (via drill 0.3, 0.6)
  Top 0.254: AMP105.OUTA AMP105.-INA 64.98,39.78 63.9,38.7 56,38.7 55.1,37.8 55.1,36.2 54.9,36 54.2,36 53.55,35.35 53.55,34.4 53,33.85 47.55,33.85 47.15,33.45 47.15,29.55 v46.65,29.05 46.85,29.25 | v28.45,34.7 28.45,36.25 28.25,36.45 26.05,36.45 MPX101.S7B
  Route2 0.254: v28.45,34.7 28.45,34.2 29.1,33.55 34,33.55 36.1,31.45 39.9,31.45 42.3,29.05 v46.65,29.05
@P_THERMO_PIC  (via drill 0.3, 0.6)
  Top 0.254: 25.4,38.35 26,38.35 MPX101.S4B 27.2,38.35 27.85,39 v27.85,40.1
  Route2 0.254: v40.9,50.15 40.4,49.65 36.1,49.65 35.3,48.85 32.8,48.85 29.85,45.9 29.85,45.1 28.8,44.05 27.5,44.05 26.5,43.05 26.5,40.65 27.05,40.1 v27.85,40.1
  Bottom 0.254: IC101.6 38.83,48.47 39.55,49.2 40.25,49.2 40.85,49.8 40.85,50.1 v40.9,50.15
ANNTENA_EXPAND  (via drill 0.6)
  Top 0.254: ICP1.13 ICP1.12 8.98,34.53 v9.25,34.8
  Bottom 0.254: R1036.2 9.4,36.15 10.05,35.5 10.05,34.8 | PIC101.41 12.58,25.35 10,25.35 8.95,26.4 8.95,28.2 10.05,29.3 10.05,31.65 10.95,32.55 10.95,33.85 10.05,34.75 10.05,34.8 | 10.05,34.8 v9.25,34.8
ANNTENA_EXPAND_N  (via drill 0.3, 0.6)
  Top 0.254: ICP1.11 9.7,35.8 10.15,35.35 10.15,34.4 9.15,33.4 9.15,30.75 8.75,30.35 7.6,30.35 6.75,29.5 6.75,28.7 7.25,28.2 12.25,28.2 12.25,28.25 | v41.95,40.55 40.83,41.67 Q110.G
  Top 0.305: 12.25,28.25 v13.15,29.15
  Route2 0.305: v13.15,29.15 13.45,29.45 v24.6,29.45
  Route15 0.254: v24.6,29.45 26.3,29.45 27.1,30.25 27.1,32.6 27.95,33.45 35.25,33.45 41.95,40.15 v41.95,40.55
BATTERY_HEATER  (via drill 0.6)
  Top 0.254: ICP1.9 ICP1.10 9.28,37.07 10.7,35.65 10.7,33.75 v10.05,33.1
  Bottom 0.254: PIC101.40 9.45,24.5 8.3,25.65 8.3,28.5 9.3,29.5 9.3,30.5 9.3,32.35 v10.05,33.1 9.6,33.55 R1035.2
BATTERY_HEATER_N  (via drill 0.3, 0.6)
  Top 0.254: v42.1,30.7 43.7,32.3 Q109.G | ICP1.8 7.43,40.18 7.7,40.45 v9,40.45
  Route2 0.254: v42.1,30.7 41.6,30.7 39.8,32.5 37.05,32.5 35.25,34.3 30.1,34.3 28.85,35.55 22.45,35.55 21.05,34.15 17.75,34.15 16.85,35.05 16.8,35.05 16,35.85 14.7,35.85 10.1,40.45 v9,40.45
BATTERY_THERMO1
  Bottom 0.254: IC104.6 38.74,15.24 38.35,14.85 36,14.85 35.6,14.45 34.15,14.45 33.6,15 29.05,15 28.5,14.45 25,14.45 23.1,16.35 21.85,16.35 21.6,16.6 21.6,17.87 PIC101.24
BATTERY_THERMO2  (via drill 0.6)
  Top 0.254: v27.1,22.9 24.35,22.9 23.9,22.45 23.9,21.5 23.3,20.9 22.45,20.9 21.35,19.8 v21.35,15.6
  Bottom 0.254: IC102.6 38.56,25.11 38.25,24.8 35.6,24.8 35.25,25.15 35.25,25.65 34.85,26.05 29.6,26.05 28.85,25.3 28.85,24.6 v27.1,22.9 | PIC101.25 20.83,16.12 v21.35,15.6
BATTERY_THERMO3  (via drill 0.3, 0.6)
  Top 0.254: v26.15,31.3 24.05,31.3 22.8,30.05 22.8,28.4 24.45,26.75 27.85,26.75 28.75,25.85 28.75,25.6 29.75,24.6 29.75,22.8 29.35,22.4 28.6,22.4 28.05,22.9 27.9,23.5 27.6,23.85 24.4,23.85 21.75,21.2 20.55,21.2 20.4,21.05 v20.4,20.35
  Bottom 0.254: PIC101.26 20.03,19.72 20.4,20.09 v20.4,20.35 | IC103.6 38.91,35.45 37.8,34.35 31.25,34.35 29.55,32.65 27.5,32.65 v26.15,31.3
BUS  (via drill 0.6)
  Top 0.254: 50.34,80.54 P_REG.1:RS+
  Top 0.406: Q109.S 43.67,27.75 42.35,27.75 | 50.34,80.54 50.34,79.69 50.15,79.5 v48.55,79.5
  Top 0.5: Q109.S 42.8,27.7 v41.2,26.1
  Top 0.61: 28.3,24.65 23.75,24.65 22.2,23.1
  Top 0.813: v28.9,23.4 28.9,24.05 28.3,24.65 | 22.2,23.1 21.1,23.1 20.6,23.6 19.35,23.6 18.65,22.9 18.65,21.35 17.5,20.2 13.65,20.2 12.65,21.2 12.65,23 12.3,23 11.05,24.25 5.65,24.25 4.3,25.6 4.3,34.7 3.3,35.7 3.3,42.35 1.9,43.75 | Q109.S 42.5,27.7 40.8,29.4 40.8,36.34 Q110.S | 1.9,62.35 3.1,63.55 4.45,63.55 5.05,64.15 v6.45,64.15
  Top 1.016: HCONP.B27 HCONP.B28 | 1.9,43.75 1.9,62.35
  Top 1.27: C5.1 43.72,25.85 Q109.S
  Route2 0.5: 41.05,25.95 v41.2,26.1
  Route2 0.813: HCONP.B28 49.17,61.22 50,62.05 54.9,62.05 55.45,62.6 55.45,67.9 57.35,69.8 57.35,71.75 56.6,72.5 54.5,72.5 53.35,73.65 52.65,73.65 51.25,75.05 51.25,79 50.75,79.5 v48.55,79.5 | 35.7,23.95 33.3,23.95 32.55,24.7 30.65,24.7 29.35,23.4 v28.9,23.4
  Route2 1.016: 41.05,25.95 37.7,25.95 35.7,23.95
  Route15 0.61: 18.45,63.85 18.3,64 15.2,64
  Route15 0.813: 15.2,64 12.4,64 12.25,63.85 8.15,63.85 7.85,64.15
  Route15 1.016: HCONP.B27 47.91,62.05 47.1,62.85 19.45,62.85 18.45,63.85 | v6.45,64.15 7.85,64.15
  Bottom 0.254: SR121.P$1 45.95,78.1
  Bottom 0.406: SR121.P$1 46.36,77.75
  Bottom 0.61: SR122.P$1 50.62,77.42
  Bottom 0.813: v48.55,79.5 46.8,79.5 46.43,79.13 SR121.P$1 50.52,77.42 SR122.P$1
BUS_OUT  (via drill 0.4, 0.6)
  Top 0.406: 49.07,82.77 49.3,83 52.45,83 v53.25,82.2
  Top 0.61: v87.4,75.45 85.7,75.45 82.8,78.35 82.8,85.65 80.5,87.95 | 18.23,17.4 L101.P$1 | 49.07,82.77 P_REG.2:RS-
  Top 0.813: 80.5,87.95 58.25,87.95 58.25,87.8 55.05,84.6 55.05,83.15 54.2,82.3 53.35,82.3 v53.25,82.2
  Top 1.016: 12.65,16.55 12.65,13.45 11.9,12.7 v11.4,12.7 | C1.1 78.4,14.15 81.22,11.33 REGP1.VIN:5
  Top 1.422: 18.23,17.4 13.5,17.4 12.65,16.55
  Route2 0.406: 20.25,55.55 v20.3,55.5 13.95,55.5 13.55,55.1 11.95,55.1 11.65,55.4 11.65,62.15 12.75,63.25
  Route2 0.61: v87.4,75.45 87.5,75.35 87.5,71.35 90.25,68.6 90.25,51.1 88.3,49.15 86.85,49.15 86.4,48.7 86.4,47.05 85.9,46.55 80.3,46.55 79.45,45.7 REGP2.VIN:5 | v28.75,84 27.85,83.1 26.15,83.1 19.3,76.25 18.6,76.25 12.75,70.4 12.75,63.25
  Route15 0.61: 33.4,16.7 38.75,16.7 39.2,17.15 42.75,17.15
  Route15 1.016: v80.5,29.25 78,29.25 76,27.25 76,26.05 73.9,23.95 73.9,19.75 77.65,16 77.65,15 81.22,11.43 REGP1.VIN:5
  Route15 1.27: REGP1.VIN:5 81.22,10.97 79.4,9.15 72.25,9.15 71.95,9.45 71.95,10.75 71.05,11.65 68.1,11.65 v64.45,8 60.65,8 55.9,12.75 47.8,12.75 43.4,17.15 42.75,17.15 | v11.4,12.7 12.3,11.8 22.75,11.8 26,15.05 26,16.9 27.2,18.1 31.85,18.1 33.25,16.7 33.4,16.7
  Bottom 0.254: SR121.P$2 46.36,81.75 | 51.05,81.75 SR122.P$2 | v20.3,55.5 20.3,54.26 R1020.2
  Bottom 0.406: C155.1 78.25,50.95 | C146.1 71.25,9.45 75.35,9.45 76.15,10.25 76.15,12.2 76.45,12.5 78.95,12.5 79.5,11.95 79.5,11.35 79.82,11.03 REGP1.VIN:5 | SR122.P$2 50.62,81.42
  Bottom 0.61: 51.8,82.5 51.05,81.75 | 50.62,81.42 SR121.P$2 45.48,81.42 | C155.1 78.33,47.17 79.45,46.05 REGP2.VIN:5
  Bottom 0.813: 45.48,81.42 44.98,81.42 43.5,82.9 43.5,83.2 42.65,84.05 42.3,84.05 41.7,84.65 41.7,85.8 41.2,86.3 36.75,86.3 36.15,85.7 36.15,84.95 35.75,84.55 35.5,84.55 34.7,83.75 29,83.75 v28.75,84 | 51.8,82.5 52.95,82.5 v53.25,82.2
  Bottom 1.016: 78.6,29.75 79.1,29.25 v80.5,29.25 | 79.43,44.65 REGP2.VIN:5 79.45,43.05 78.35,41.95 | 78.35,41.95 C4.1 | 78.35,41.95 77.52,41.12 L102.P$1
  Bottom 1.27: L102.P$1 77.52,30.83 78.6,29.75
BUS_OUT_P_ATN  (via drill 1)
  Top 1.016: Q110.D 50.28,39.37 v50.3,39.35
BUS_OUT_P_ATN_2  (via drill 1)
  Route2 1.016: v52.1,37.45 v50.25,37.45
BUS_OUT_P_HTR  (via drill 0.6)
  Top 0.406: 61,28.5 60.7,28.8 60.7,29.3 | v57.9,32.85 58.1,32.65
  Top 0.61: 61,28.5 61.1,28.4 64.65,28.4 64.7,28.45 66.5,28.45 66.75,28.2 | 58.1,32.65 59.8,32.65 60.2,32.25 60.2,29.8 60.7,29.3
  Top 0.813: BCNP3.1 70.08,19.87 68.45,21.5 68.45,25.8 67,27.25 67,27.95 66.75,28.2
  Bottom 0.254: 51,33.9 SR135.P$2
  Bottom 0.406: 51,33.9 51,32.25 50.6,31.85 49,31.85 48.3,31.15 48.3,28.4 47.85,27.95 46.25,27.95 45.9,27.6 45.9,26.19 P_HTR.2:RS- 45.92,24.88 46.2,24.6 48.05,24.6 v48.6,25.15 | v57.9,32.85 56.2,32.85 SR136.P$2
  Bottom 0.813: SR135.P$2 55.03,33.92 SR136.P$2
CHARGE_A_VOL  (via drill 0.3, 0.6)
  Top 0.254: v19.15,71.3 19.15,71.25 18.75,70.85 18.75,69.3 19.2,68.85 19.9,68.85 20.4,68.35 20.4,67.6 21.5,66.5 22.8,66.5 24.02,67.72 LD102.K | v22.35,49.6 23.5,48.45 25.85,48.45 26.15,48.15 AMP106.+INA 26.15,47.65
  Route15 0.254: v22.35,49.6 21.8,49.05 12,49.05 9.7,46.75 6.1,46.75 5.65,47.2 5.65,48.15 3.3,50.5 3.3,68.8 3.85,69.35 8.9,69.35 9.2,69.05 9.2,67 9.7,66.5 23.55,66.5 24.07,67.02 24.02,67.07 LD102.K
  Bottom 0.254: v19.15,71.3 19.27,71.42 CHARGE_IC.P$11
CHARGE_A_VOL_AMP  (via drill 0.4)
  Top 0.254: 16.9,47.6 v16.6,47.3 17.1,47.8 23.3,47.8 24.3,46.8 24.75,46.8 24.85,46.9 AMP106.OUTA AMP106.-INA
  Bottom 0.254: MPX102.S6B 14.3,48.05 14.3,48.04 14.3,47.8 14.65,47.45 16.45,47.45 v16.6,47.3
CHARGE_B_VOL  (via drill 0.3)
  Top 0.254: v22.9,55.4 23.35,54.95 24.4,54.95 24.8,55.35 24.8,55.7 25.05,55.95 26.35,55.95 26.75,55.55 26.75,54.55 26.45,54.25 26.25,54.25 26.15,54.15 AMP106.+IND
  Route15 0.254: 15.55,69.1 16.25,68.4 17.35,68.4 18.9,69.95 19.72,69.95 LD101.K | 3.05,49.2 3.55,48.7 4,48.7 4.75,47.95 4.75,46.75 5.4,46.1 10.2,46.1 12.6,48.5 23,48.5 24.25,47.25 26.35,47.25 26.95,47.85 26.95,48.6 27.3,48.95 30.1,48.95 31.8,50.65 31.8,53.05 31.15,53.7 29.35,53.7 29.05,54 29.05,55.8 28.65,56.2 23.5,56.2 22.9,55.6 v22.9,55.4
  Route15 0.406: 15.55,69.1 13.8,69.1 13.3,69.6 13.3,71.7 12.75,72.25 7.4,72.25 5.25,70.1 3.05,70.1 2.5,69.55 2.5,49.75 3.05,49.2
  Bottom 0.254: CHARGE_IC.P$12 19.93,72.07 20.25,71.75 20.25,71 19.93,70.68 19.93,70.06 LD101.K
CHARGE_B_VOL_AMP  (via drill 0.6)
  Top 0.254: v14.4,52.05 13.9,52.55 13.9,54.8 14.35,55.25 17.6,55.25 19.7,53.15 21.57,53.15 22.32,53.9 24.4,53.9 24.7,53.9 | 24.7,53.9 24.85,53.75 AMP106.OUTD | AMP106.-IND 25.5,53.75 25.35,53.9 24.7,53.9
  Bottom 0.254: v14.4,52.05 14.96,51.5 MPX102.S5B
CHARGE_LINE  (via drill 0.6)
  Top 0.254: Q101.P$1 11.48,73.56 R107.1 9.86,74.7 7.2,74.7 6,73.5 v6,72.6
  Route15 0.254: 2.3,44.4 3.9,42.8 3.9,36 8.25,31.65 11.45,31.65 12.95,33.15 | 4.35,70.95 4,70.6 2.45,70.6 1.45,69.6 1.45,45.2
  Route15 0.305: 12.95,33.15 v15.95,33.15
  Route15 0.406: 4.35,70.95 v6,72.6 | 1.45,45.2 2.25,44.4 2.3,44.4
  Bottom 0.254: PIC101.4 16.83,30.72 16.3,31.25 16.3,32.8 v15.95,33.15
CHARGE_RESET  (via drill 0.3, 0.6)
  Top 0.254: v13.8,84.2 12.25,84.2 8.3,80.25 8.3,77.4 4.1,73.2 4.1,71.75 3.6,71.25 1.05,71.25 arc90 0.75,70.95 0.75,49.5 arc90 0.9,49.35 0.9,42.4 1.65,41.65 v2,41.65
  Route2 0.254: v15.75,36.9 14.5,36.9 10.2,41.2 8.3,41.2 6.85,39.75 5,39.75 3.1,41.65 v2,41.65
  Bottom 0.254: R109.1 12.92,80.18 Q102.P$1 12.99,83.39 v13.8,84.2 | PIC101.5 17.63,30.67 17,31.3 17,33.25 17.4,33.65 17.4,34.45 15.75,36.1 v15.75,36.9
COMP_OUT_BAT  (via drill 0.3)
  Top 0.254: LI.6:OUT 29.9,84.9 29.51,85.29 R1017.2 26.84,85.29 v26.25,84.7 | v60.8,50.15 60.8,50.9 60.65,51.05 59.38,51.05 AMP102.+IND
  Route2 0.254: v60.8,50.15 62.05,48.9 70.45,48.9 71.7,50.15 74.35,50.15 77.65,53.45 82.65,53.45 83.85,52.25 v83.85,50.95
  Route15 0.254: v26.25,84.7 28.55,87 35,87 37,85 37,82.4 37.3,82.1 37.7,82.1 38.2,81.6 38.2,79.2 38.5,78.9 40.5,78.9 40.9,78.5 53.1,78.5 59.35,84.75 60.2,84.75 62.45,87 74.3,87 80.2,81.1 80.2,77.85 90.6,67.45 90.6,51.35 89.6,50.35 84.45,50.35 v83.85,50.95